# EAGLE design power_supply_module (EAGLE 6.6.0)
AUTHOR: N. Jackson; REV: A; TITLE: Power Supply Module

## Sheet 1 of 9
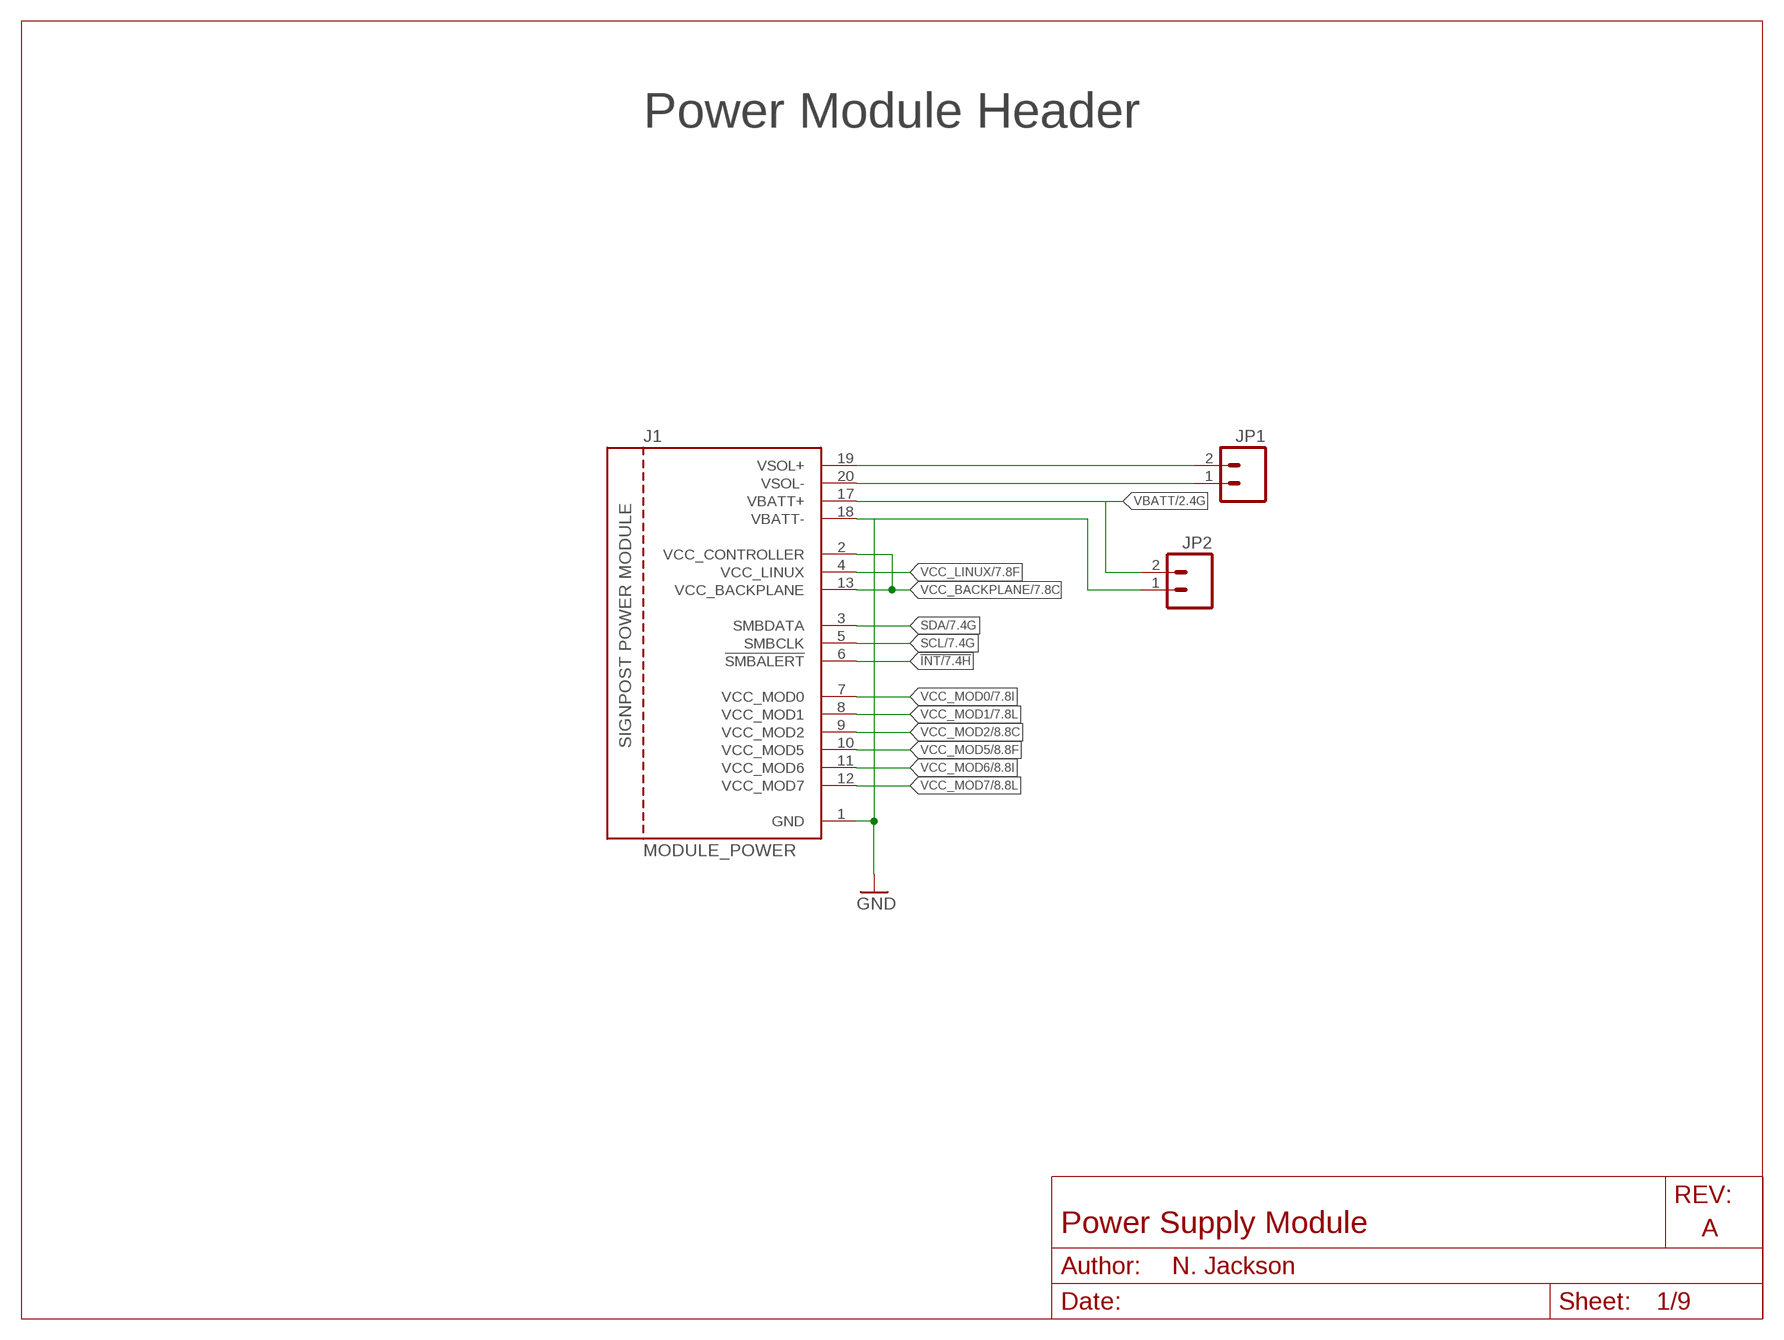
[diagram p0: schematic, sheet 1]

### Parts
J1  MODULE_POWER  [MODULE_POWER]
JP1  M02PTH  [1X02]
JP2  M02PTH  [1X02]

### Nets
!INT: J1.6(!SMBALERT) ; also sheet 7,8,9
GND: J1.1(GND) J1.18(VBATT-) JP2.1 ; also sheet 2,3,4,5,6,7,8,9
SCL: J1.5(SMBCLK) ; also sheet 7,8,9
SDA: J1.3(SMBDATA) ; also sheet 7,8,9
VBATT: J1.17(VBATT+) JP2.2 ; also sheet 2,3,4,5,6,9
VCC_BACKPLANE: J1.2(VCC_CONTROLLER) J1.13(VCC_BACKPLANE) ; also sheet 7,8,9
VCC_LINUX: J1.4(VCC_LINUX) ; also sheet 7,9
VCC_MOD0: J1.7(VCC_MOD0) ; also sheet 7,9
VCC_MOD1: J1.8(VCC_MOD1) ; also sheet 7,9
VCC_MOD2: J1.9(VCC_MOD2) ; also sheet 8,9
VCC_MOD5: J1.10(VCC_MOD5) ; also sheet 8,9
VCC_MOD6: J1.11(VCC_MOD6) ; also sheet 8,9
VCC_MOD7: J1.12(VCC_MOD7) ; also sheet 8,9
VSOL+: J1.19(VSOL+) JP1.2 ; also sheet 9
VSOL-: J1.20(VSOL-) JP1.1 ; also sheet 9

### Notes on the sheet
- Power Module Header

## Sheet 2 of 9
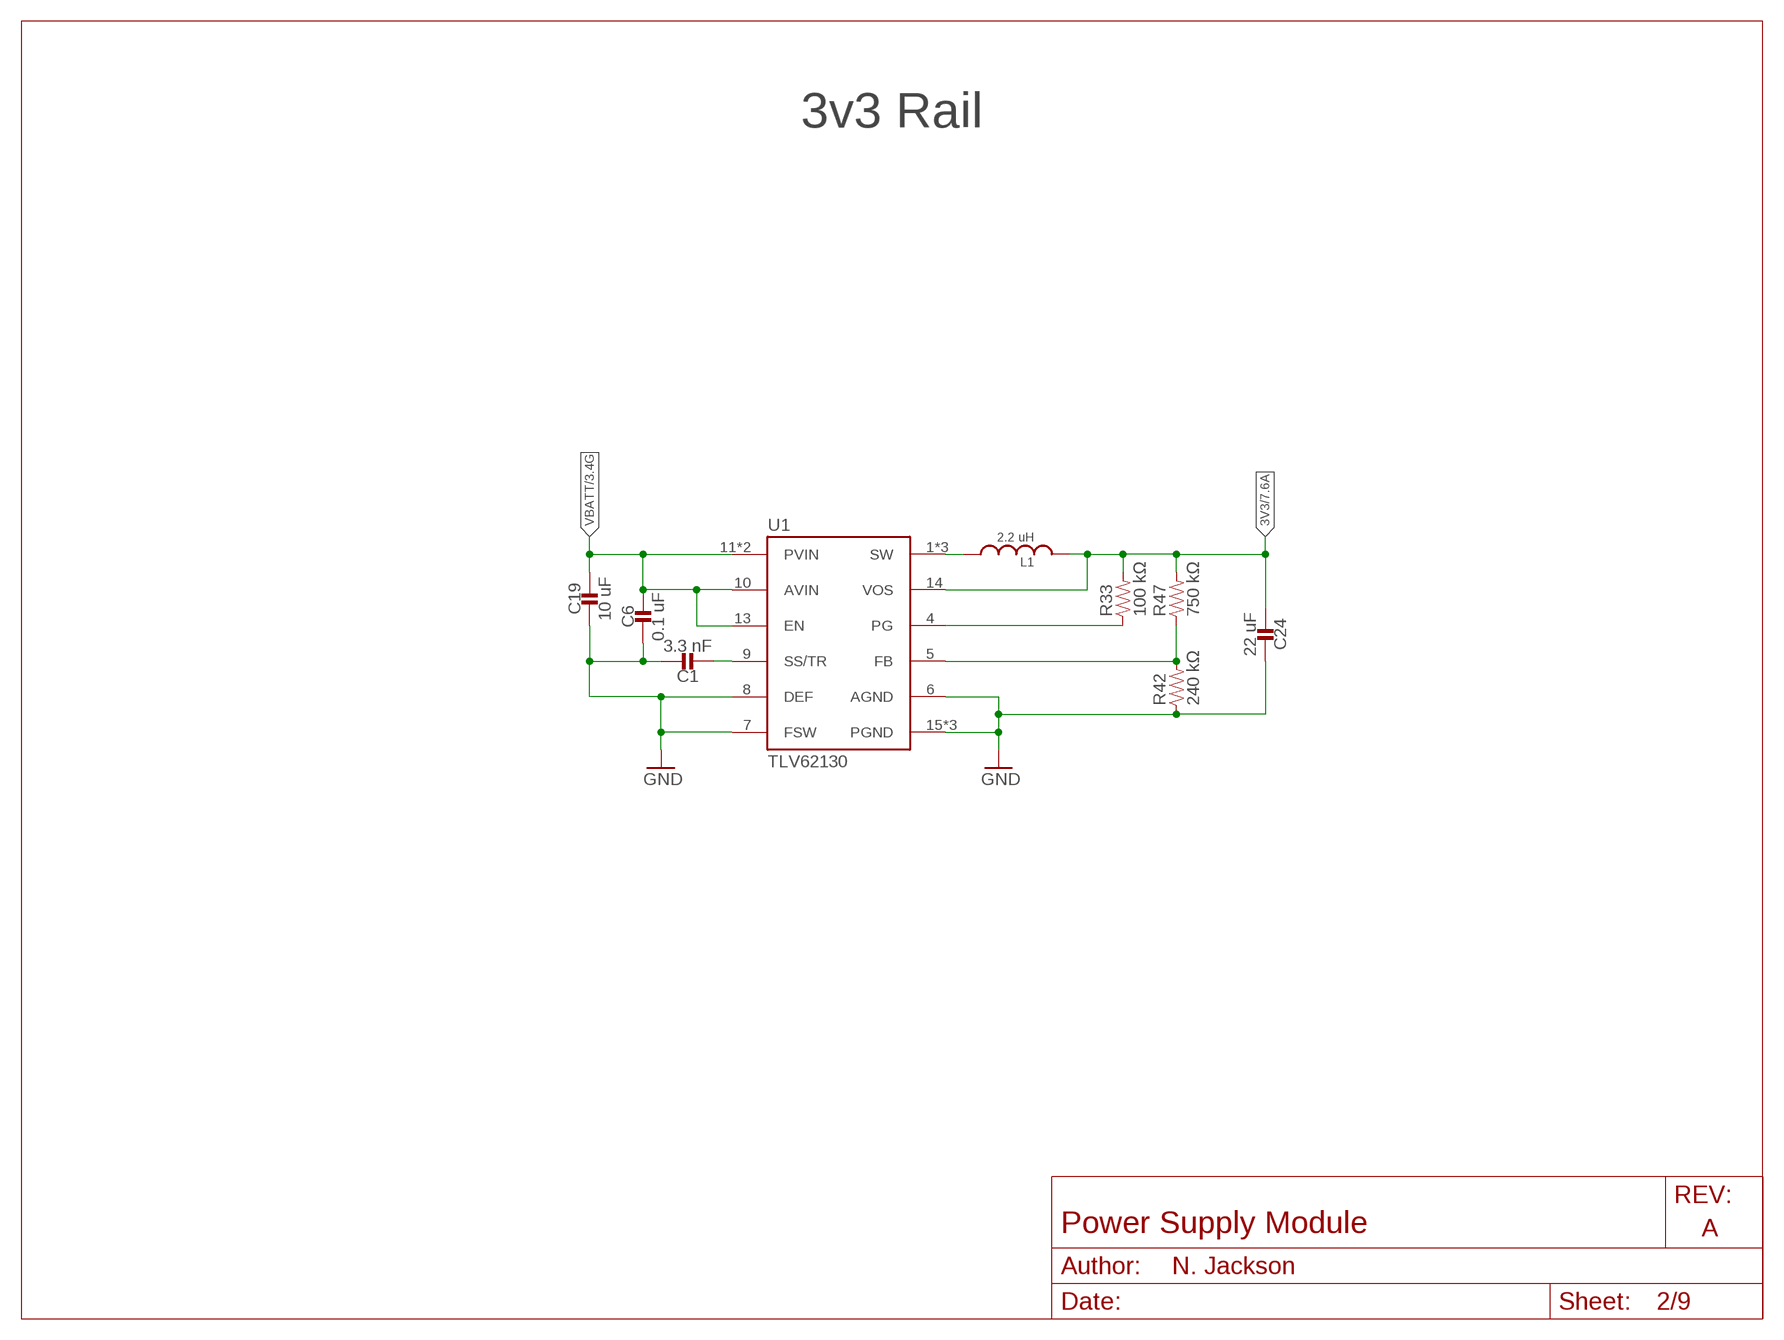
[diagram p1: schematic, sheet 2]

### Parts
C1  3.3 nF  CAPACITOR0402_CAP  [0402_CAP]
C6  0.1 uF  CAPACITOR0402_CAP  [0402_CAP]
C19  10 uF  CAPACITOR0805_CAP  [0805_CAP]
C24  22 uF  CAPACITOR0603_CAP  [0603_CAP]
L1  2.2 uH  INDUCTORIHL  [IHL-1212BZ-11]
R33  100 kΩ  RESISTOR0402_RES  [0402_RES]
R42  240 kΩ  RESISTOR0402_RES  [0402_RES]
R47  750 kΩ  RESISTOR0402_RES  [0402_RES]
U1  TLV62130  [TQFN-16/3MM]

### Nets
3V3: C24.2 L1.P$2 R33.2 R47.2 U1.14(VOS) ; also sheet 7,9
GND: C1.1 C6.2 C19.P$2 C24.1 R42.1 U1.6(AGND) U1.7(FSW) U1.8(DEF) U1.15(PGND) U1.16(PGND) U1.GND ; also sheet 1,3,4,5,6,7,8,9
N$61: C1.2 U1.9(SS/TR)
N$62: L1.P$1 U1.1(SW) U1.2(SW) U1.3(SW)
N$63: R33.1 U1.4(PG)
N$64: R42.2 R47.1 U1.5(FB)
VBATT: C6.1 C19.P$1 U1.10(AVIN) U1.11(PVIN) U1.12(PVIN) U1.13(EN) ; also sheet 1,3,4,5,6,9

### Notes on the sheet
- 3v3 Rail

## Sheet 3 of 9
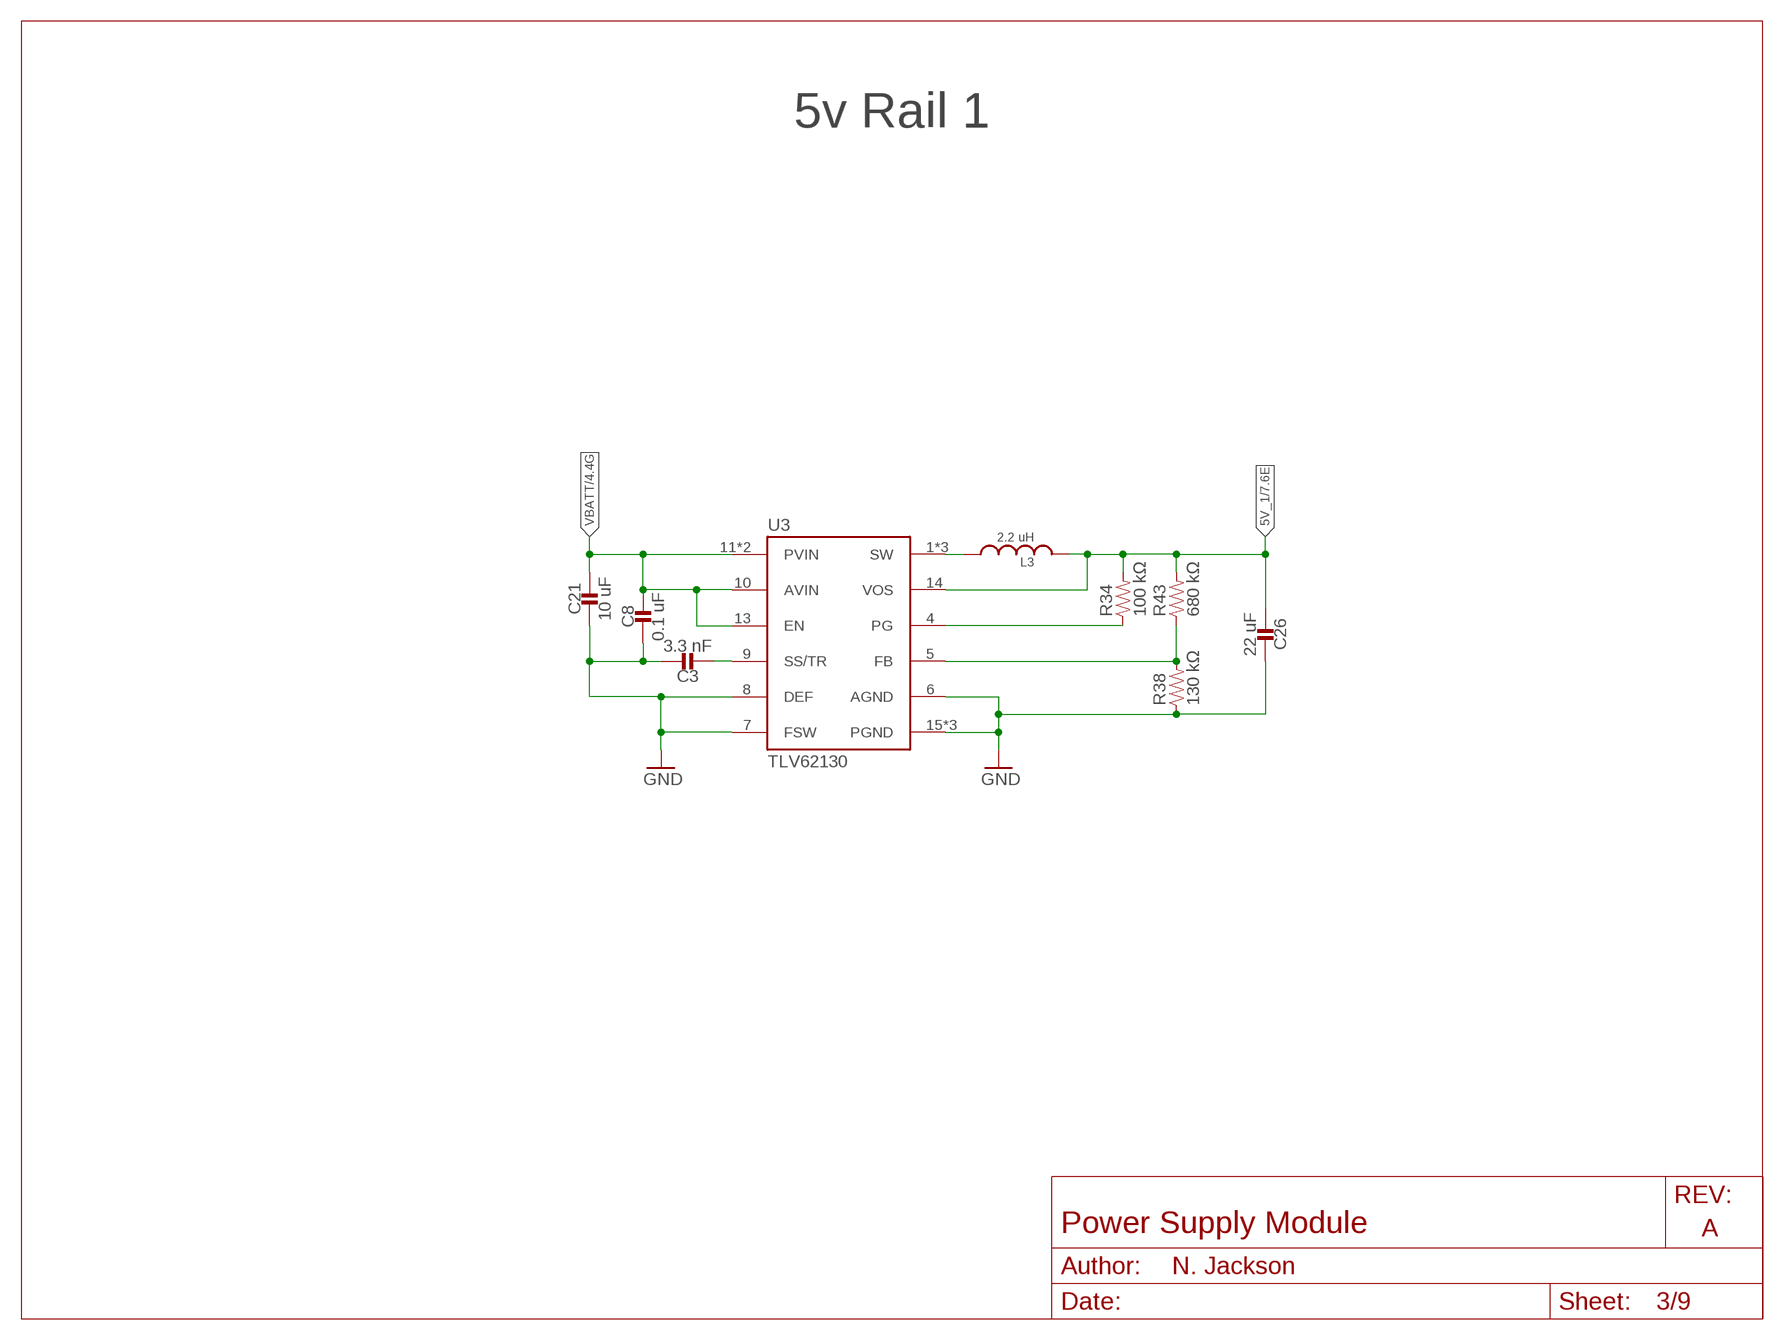
[diagram p2: schematic, sheet 3]

### Parts
C3  3.3 nF  CAPACITOR0402_CAP  [0402_CAP]
C8  0.1 uF  CAPACITOR0402_CAP  [0402_CAP]
C21  10 uF  CAPACITOR0805_CAP  [0805_CAP]
C26  22 uF  CAPACITOR0603_CAP  [0603_CAP]
L3  2.2 uH  INDUCTORIHL  [IHL-1212BZ-11]
R34  100 kΩ  RESISTOR0402_RES  [0402_RES]
R38  130 kΩ  RESISTOR0402_RES  [0402_RES]
R43  680 kΩ  RESISTOR0402_RES  [0402_RES]
U3  TLV62130  [TQFN-16/3MM]

### Nets
5V_1: C26.2 L3.P$2 R34.2 R43.2 U3.14(VOS) ; also sheet 7,9
GND: C3.1 C8.2 C21.P$2 C26.1 R38.1 U3.6(AGND) U3.7(FSW) U3.8(DEF) U3.15(PGND) U3.16(PGND) U3.GND ; also sheet 1,2,4,5,6,7,8,9
N$5: C3.2 U3.9(SS/TR)
N$6: L3.P$1 U3.1(SW) U3.2(SW) U3.3(SW)
N$7: R34.1 U3.4(PG)
N$9: R38.2 R43.1 U3.5(FB)
VBATT: C8.1 C21.P$1 U3.10(AVIN) U3.11(PVIN) U3.12(PVIN) U3.13(EN) ; also sheet 1,2,4,5,6,9

### Notes on the sheet
- 5v Rail 1

## Sheet 4 of 9
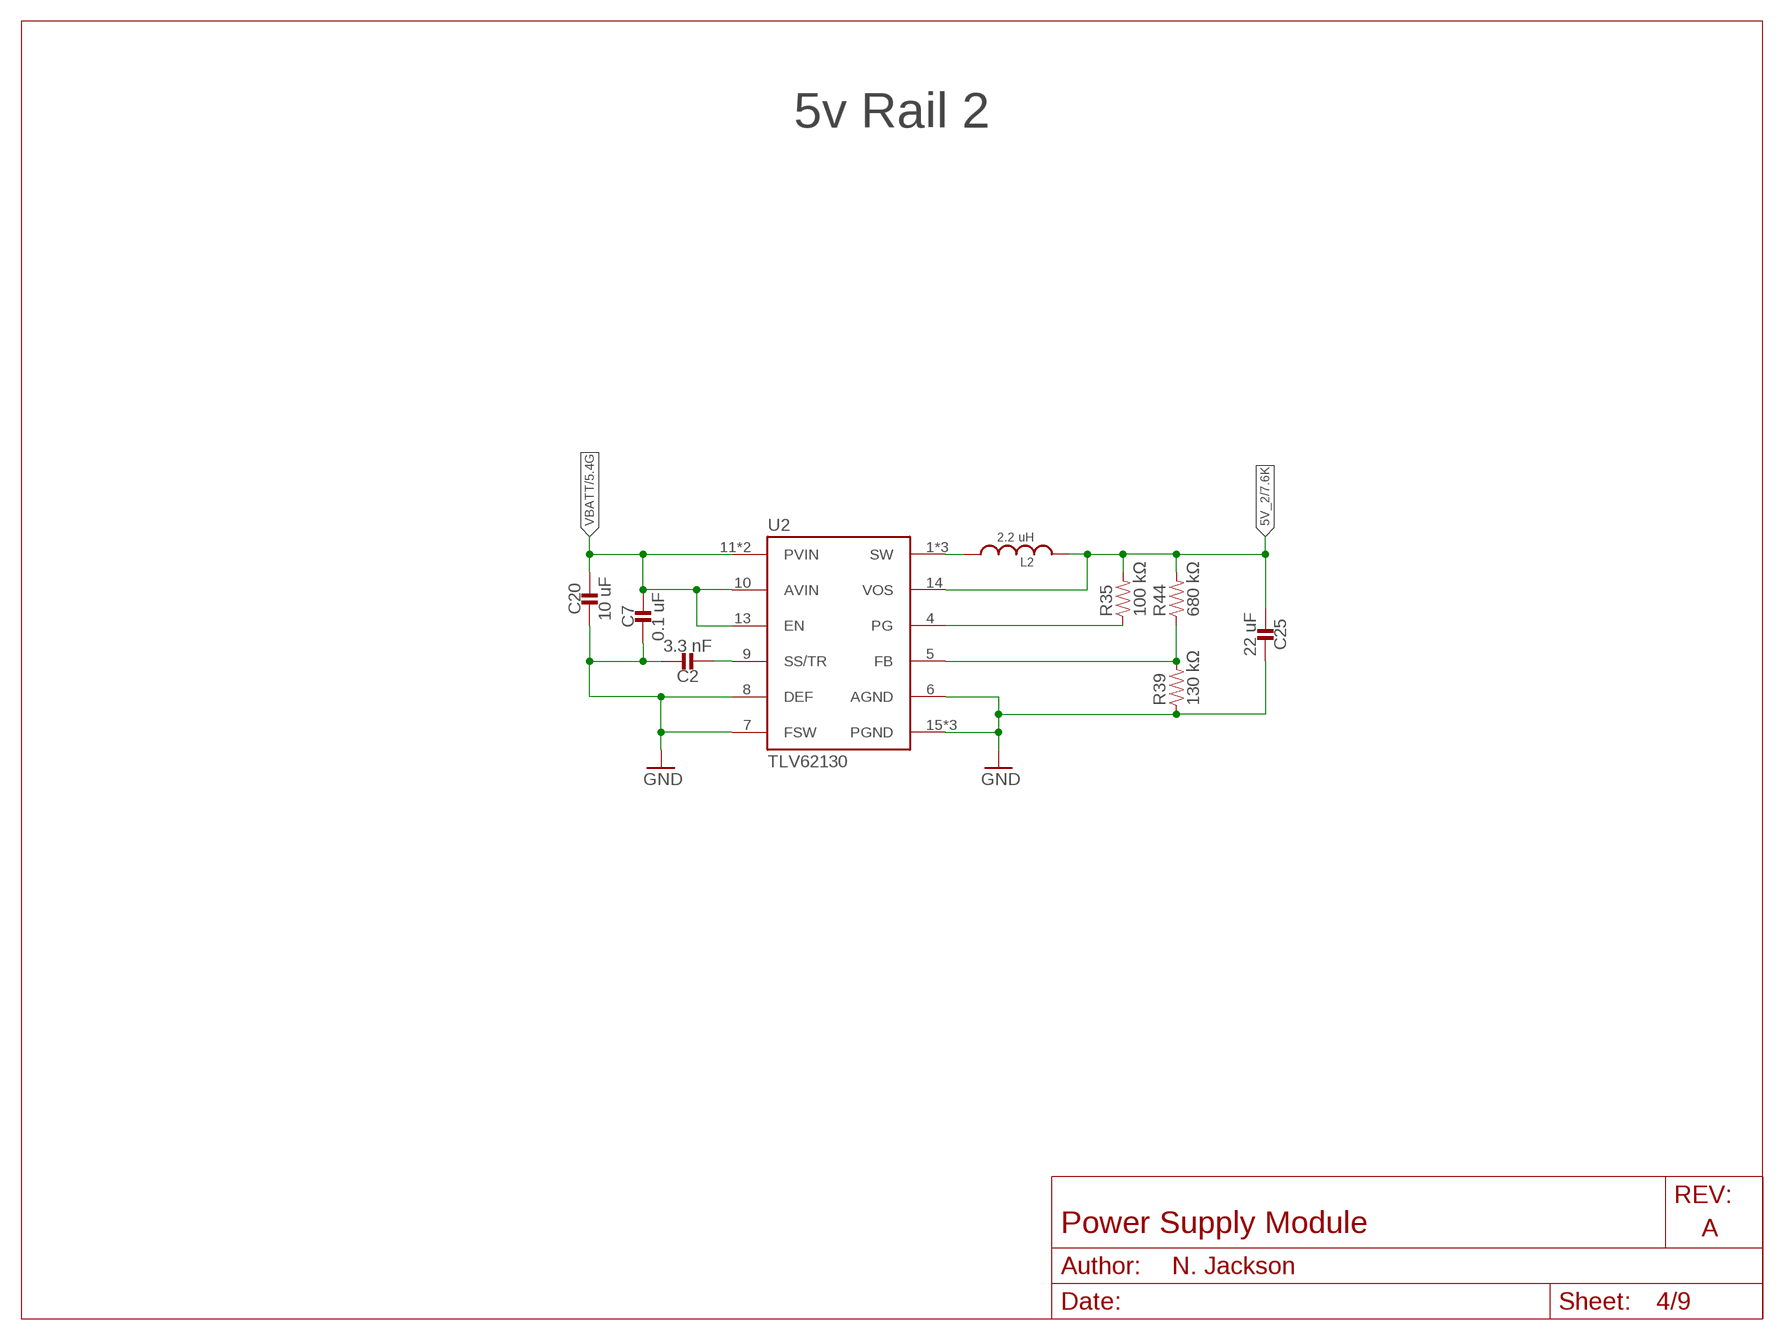
[diagram p3: schematic, sheet 4]

### Parts
C2  3.3 nF  CAPACITOR0402_CAP  [0402_CAP]
C7  0.1 uF  CAPACITOR0402_CAP  [0402_CAP]
C20  10 uF  CAPACITOR0805_CAP  [0805_CAP]
C25  22 uF  CAPACITOR0603_CAP  [0603_CAP]
L2  2.2 uH  INDUCTORIHL  [IHL-1212BZ-11]
R35  100 kΩ  RESISTOR0402_RES  [0402_RES]
R39  130 kΩ  RESISTOR0402_RES  [0402_RES]
R44  680 kΩ  RESISTOR0402_RES  [0402_RES]
U2  TLV62130  [TQFN-16/3MM]

### Nets
5V_2: C25.2 L2.P$2 R35.2 R44.2 U2.14(VOS) ; also sheet 7,9
GND: C2.1 C7.2 C20.P$2 C25.1 R39.1 U2.6(AGND) U2.7(FSW) U2.8(DEF) U2.15(PGND) U2.16(PGND) U2.GND ; also sheet 1,2,3,5,6,7,8,9
N$1: C2.2 U2.9(SS/TR)
N$2: L2.P$1 U2.1(SW) U2.2(SW) U2.3(SW)
N$3: R35.1 U2.4(PG)
N$4: R39.2 R44.1 U2.5(FB)
VBATT: C7.1 C20.P$1 U2.10(AVIN) U2.11(PVIN) U2.12(PVIN) U2.13(EN) ; also sheet 1,2,3,5,6,9

### Notes on the sheet
- 5v Rail 2

## Sheet 5 of 9
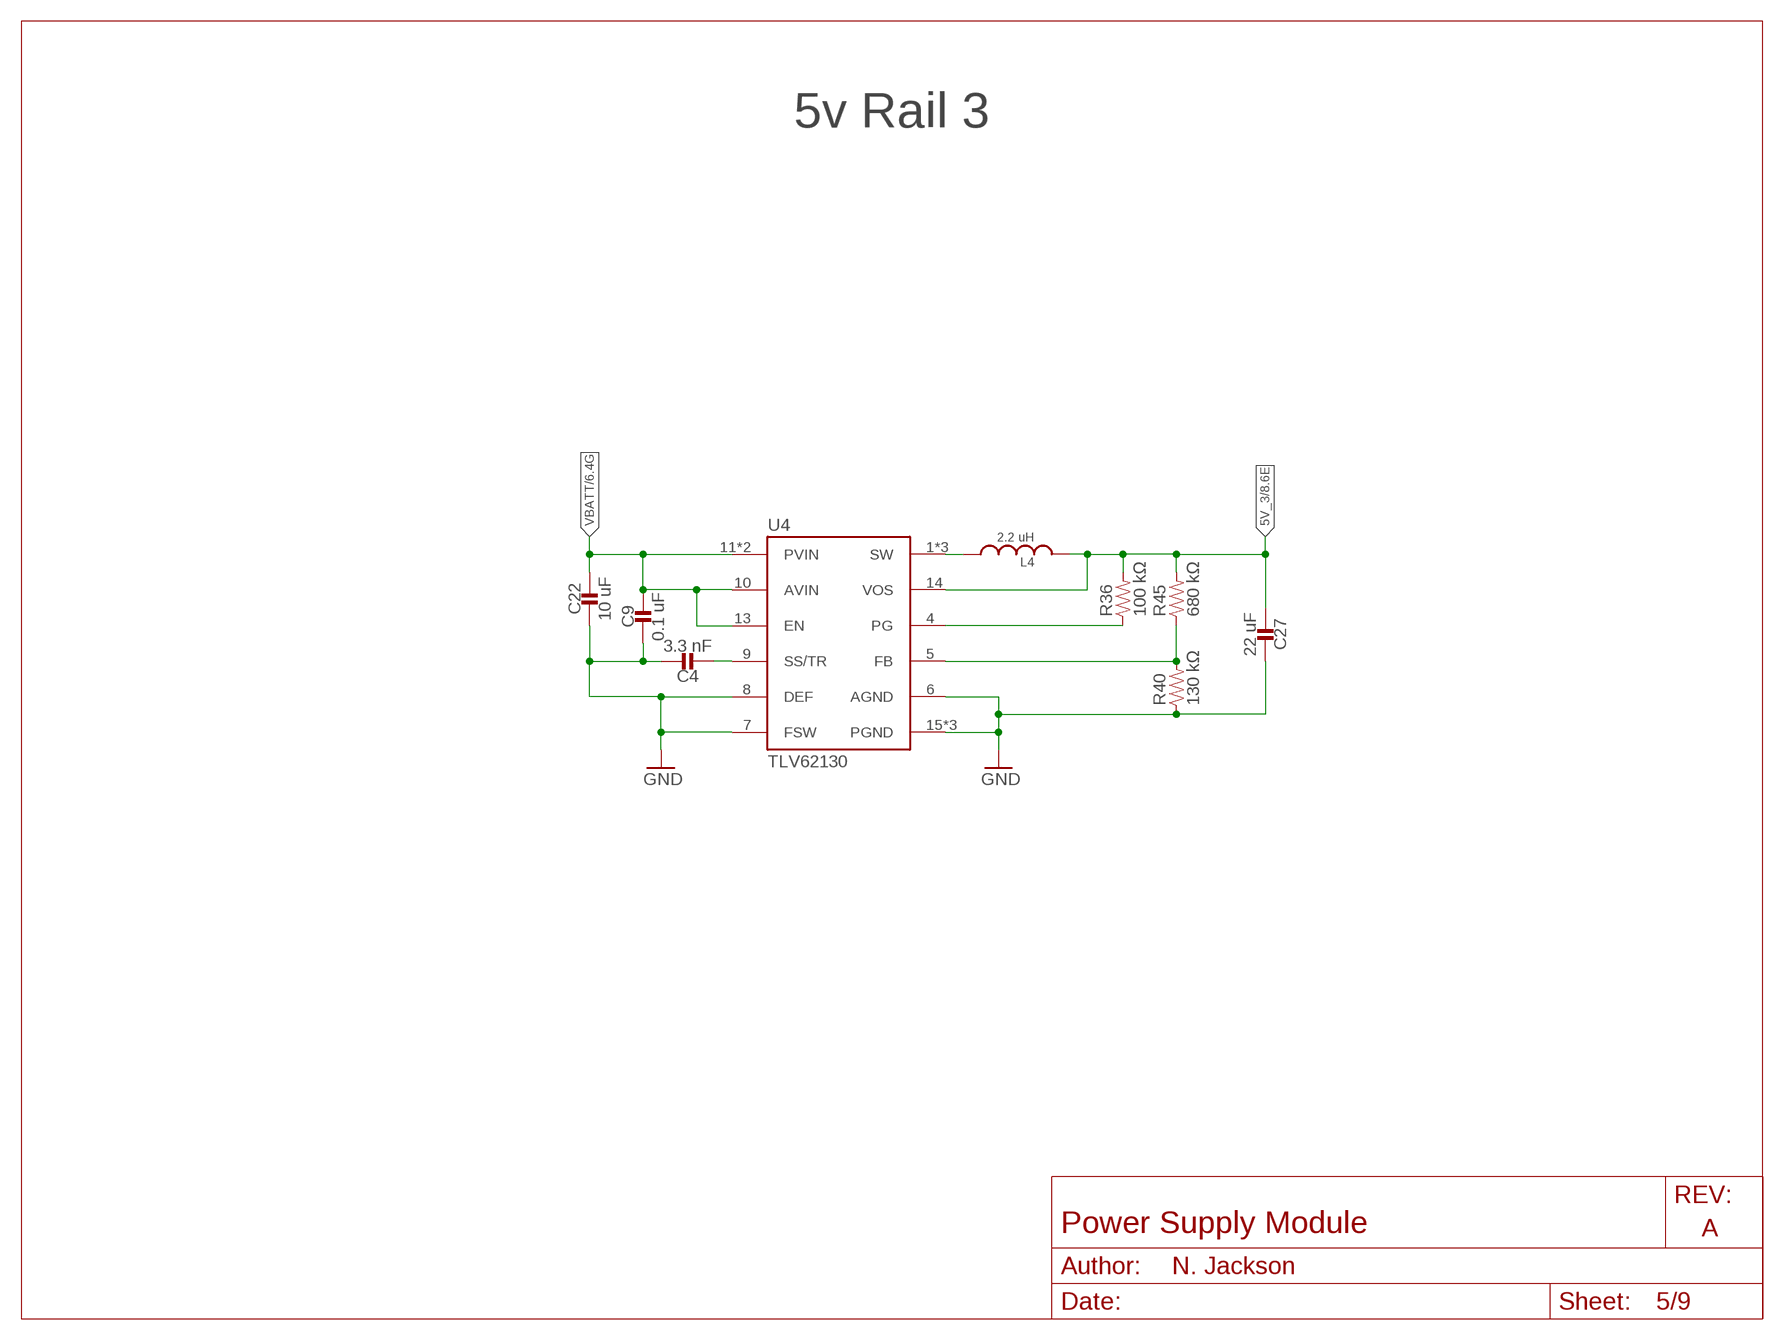
[diagram p4: schematic, sheet 5]

### Parts
C4  3.3 nF  CAPACITOR0402_CAP  [0402_CAP]
C9  0.1 uF  CAPACITOR0402_CAP  [0402_CAP]
C22  10 uF  CAPACITOR0805_CAP  [0805_CAP]
C27  22 uF  CAPACITOR0603_CAP  [0603_CAP]
L4  2.2 uH  INDUCTORIHL  [IHL-1212BZ-11]
R36  100 kΩ  RESISTOR0402_RES  [0402_RES]
R40  130 kΩ  RESISTOR0402_RES  [0402_RES]
R45  680 kΩ  RESISTOR0402_RES  [0402_RES]
U4  TLV62130  [TQFN-16/3MM]

### Nets
5V_3: C27.2 L4.P$2 R36.2 R45.2 U4.14(VOS) ; also sheet 8,9
GND: C4.1 C9.2 C22.P$2 C27.1 R40.1 U4.6(AGND) U4.7(FSW) U4.8(DEF) U4.15(PGND) U4.16(PGND) U4.GND ; also sheet 1,2,3,4,6,7,8,9
N$8: C4.2 U4.9(SS/TR)
N$10: L4.P$1 U4.1(SW) U4.2(SW) U4.3(SW)
N$11: R36.1 U4.4(PG)
N$12: R40.2 R45.1 U4.5(FB)
VBATT: C9.1 C22.P$1 U4.10(AVIN) U4.11(PVIN) U4.12(PVIN) U4.13(EN) ; also sheet 1,2,3,4,6,9

### Notes on the sheet
- 5v Rail 3

## Sheet 6 of 9
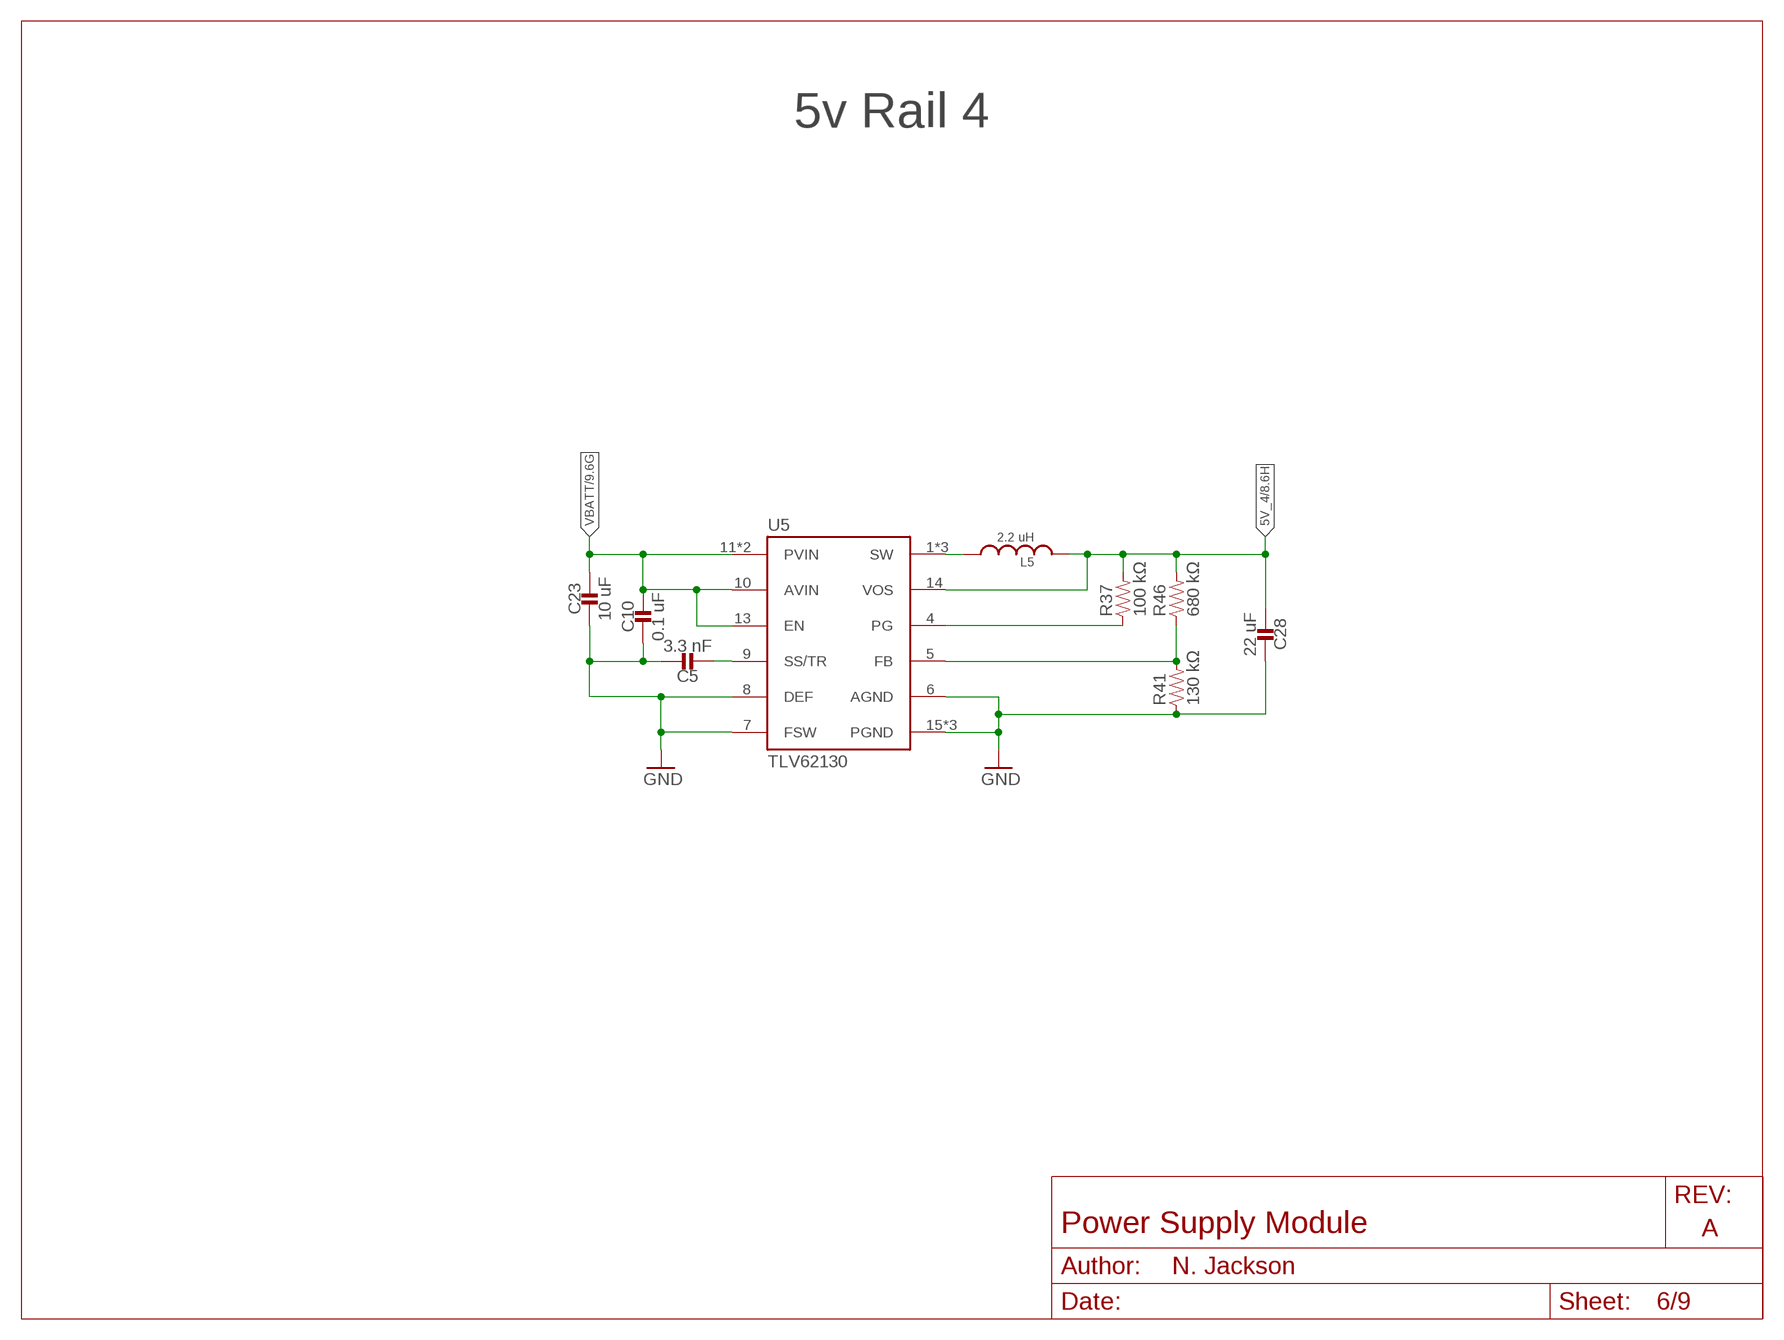
[diagram p5: schematic, sheet 6]

### Parts
C5  3.3 nF  CAPACITOR0402_CAP  [0402_CAP]
C10  0.1 uF  CAPACITOR0402_CAP  [0402_CAP]
C23  10 uF  CAPACITOR0805_CAP  [0805_CAP]
C28  22 uF  CAPACITOR0603_CAP  [0603_CAP]
L5  2.2 uH  INDUCTORIHL  [IHL-1212BZ-11]
R37  100 kΩ  RESISTOR0402_RES  [0402_RES]
R41  130 kΩ  RESISTOR0402_RES  [0402_RES]
R46  680 kΩ  RESISTOR0402_RES  [0402_RES]
U5  TLV62130  [TQFN-16/3MM]

### Nets
5V_4: C28.2 L5.P$2 R37.2 R46.2 U5.14(VOS) ; also sheet 8,9
GND: C5.1 C10.2 C23.P$2 C28.1 R41.1 U5.6(AGND) U5.7(FSW) U5.8(DEF) U5.15(PGND) U5.16(PGND) U5.GND ; also sheet 1,2,3,4,5,7,8,9
N$13: C5.2 U5.9(SS/TR)
N$14: L5.P$1 U5.1(SW) U5.2(SW) U5.3(SW)
N$15: R37.1 U5.4(PG)
N$16: R41.2 R46.1 U5.5(FB)
VBATT: C10.1 C23.P$1 U5.10(AVIN) U5.11(PVIN) U5.12(PVIN) U5.13(EN) ; also sheet 1,2,3,4,5,9

### Notes on the sheet
- 5v Rail 4

## Sheet 7 of 9
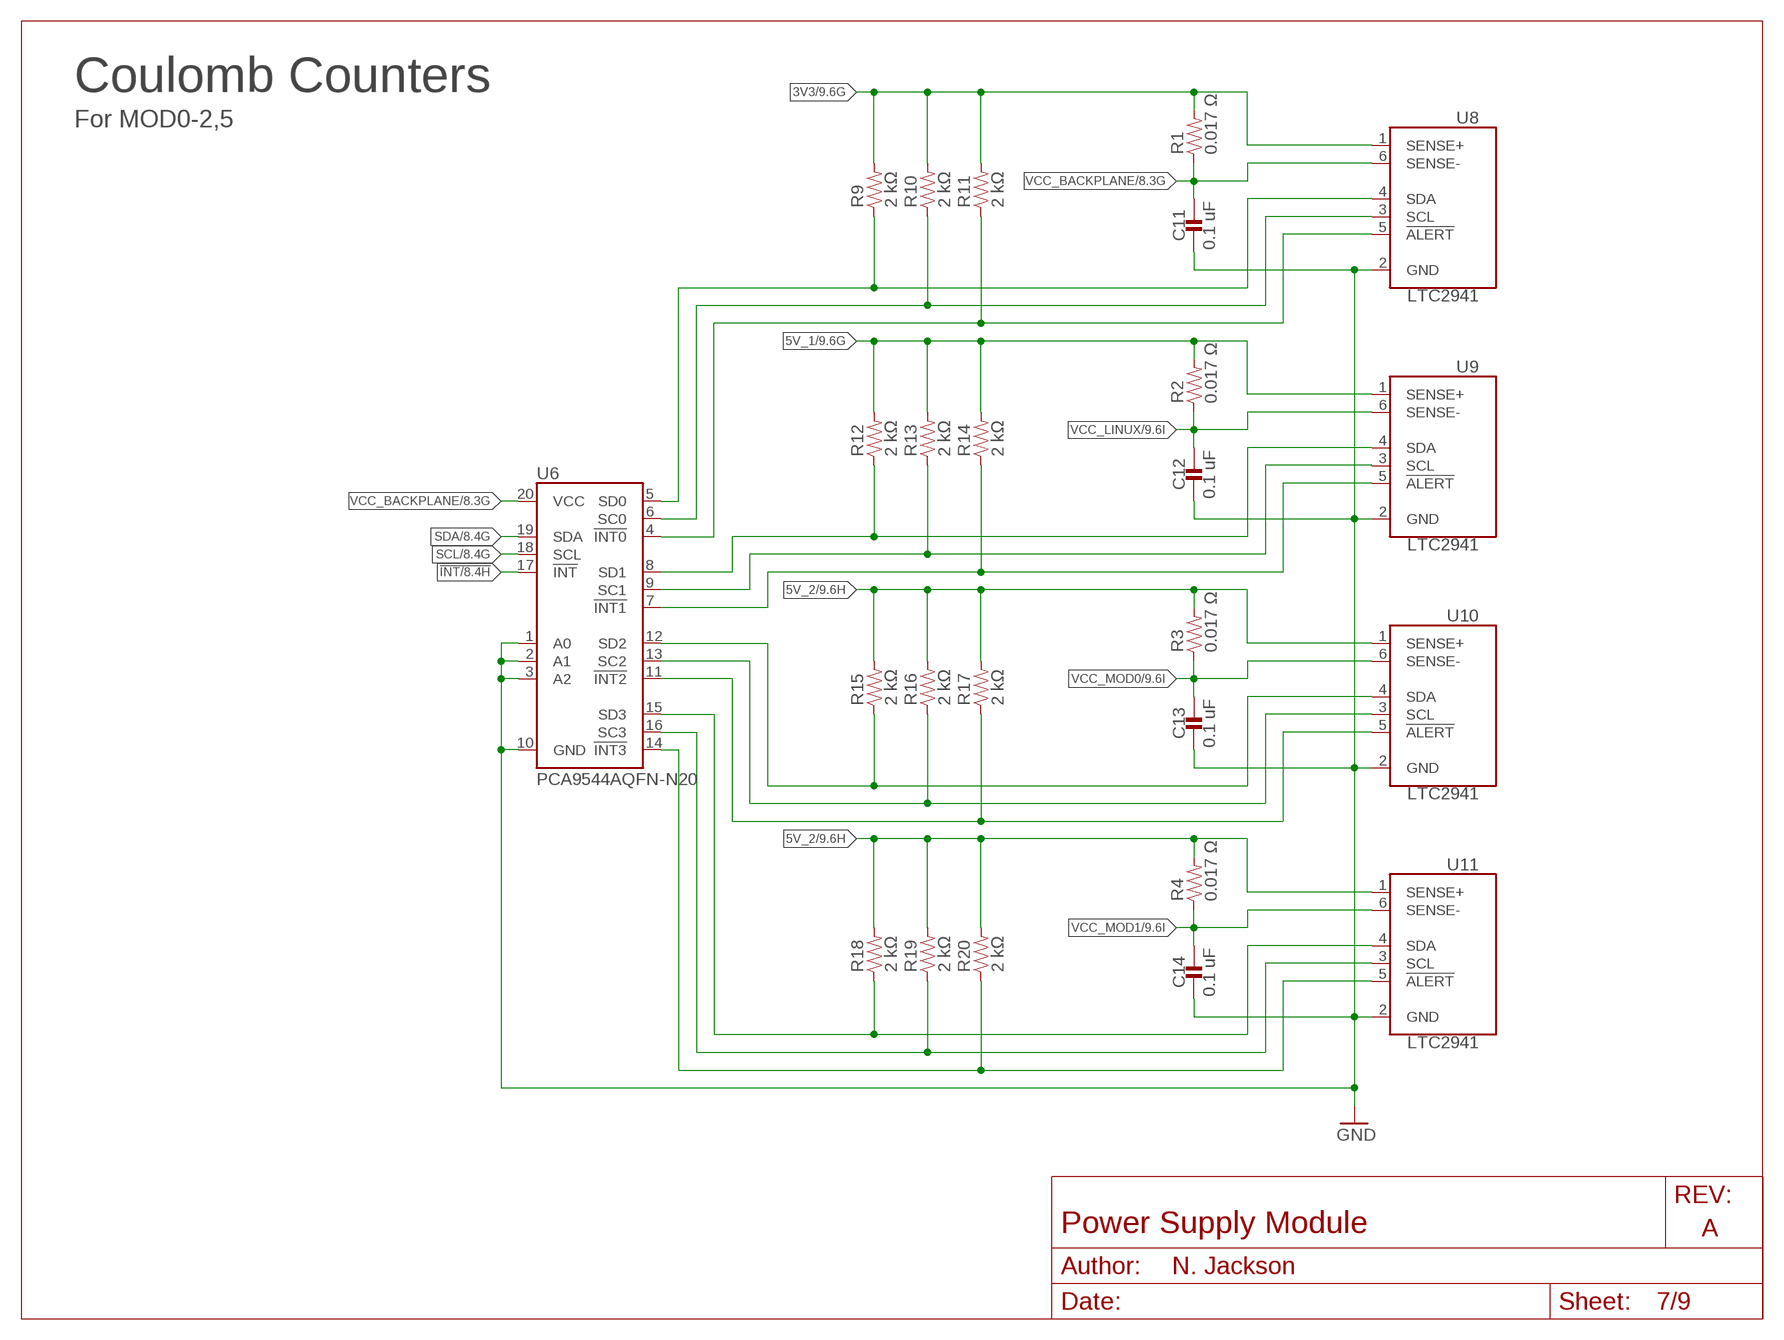
[diagram p6: schematic, sheet 7]

### Parts
C11  0.1 uF  CAPACITOR0402_CAP  [0402_CAP]
C12  0.1 uF  CAPACITOR0402_CAP  [0402_CAP]
C13  0.1 uF  CAPACITOR0402_CAP  [0402_CAP]
C14  0.1 uF  CAPACITOR0402_CAP  [0402_CAP]
R1  0.017 Ω  RESISTOR0805_RES  [0805_RES]
R2  0.017 Ω  RESISTOR0805_RES  [0805_RES]
R3  0.017 Ω  RESISTOR0805_RES  [0805_RES]
R4  0.017 Ω  RESISTOR0805_RES  [0805_RES]
R9  2 kΩ  RESISTOR0402_RES  [0402_RES]
R10  2 kΩ  RESISTOR0402_RES  [0402_RES]
R11  2 kΩ  RESISTOR0402_RES  [0402_RES]
R12  2 kΩ  RESISTOR0402_RES  [0402_RES]
R13  2 kΩ  RESISTOR0402_RES  [0402_RES]
R14  2 kΩ  RESISTOR0402_RES  [0402_RES]
R15  2 kΩ  RESISTOR0402_RES  [0402_RES]
R16  2 kΩ  RESISTOR0402_RES  [0402_RES]
R17  2 kΩ  RESISTOR0402_RES  [0402_RES]
R18  2 kΩ  RESISTOR0402_RES  [0402_RES]
R19  2 kΩ  RESISTOR0402_RES  [0402_RES]
R20  2 kΩ  RESISTOR0402_RES  [0402_RES]
U6  PCA9544AQFN-N20  [QFN-N20]
U8  LTC2941  [DFN-6-2MMX3MM]
U9  LTC2941  [DFN-6-2MMX3MM]
U10  LTC2941  [DFN-6-2MMX3MM]
U11  LTC2941  [DFN-6-2MMX3MM]

### Nets
3V3: R1.2 R9.2 R10.2 R11.2 U8.1(SENSE+) ; also sheet 2,9
5V_1: R2.2 R12.2 R13.2 R14.2 U9.1(SENSE+) ; also sheet 3,9
5V_2: R3.2 R4.2 R15.2 R16.2 R17.2 R18.2 R19.2 R20.2 U10.1(SENSE+) U11.1(SENSE+) ; also sheet 4,9
!INT: U6.17(!INT) ; also sheet 1,8,9
GND: C11.2 C12.2 C13.2 C14.2 U6.1(A0) U6.2(A1) U6.3(A2) U6.10(GND) U8.2(GND) U9.2(GND) U10.2(GND) U11.2(GND) ; also sheet 1,2,3,4,5,6,8,9
N$43: R9.1 U6.5(SD0) U8.4(SDA)
N$47: R10.1 U6.6(SC0) U8.3(SCL)
N$52: R15.1 U6.12(SD2) U10.4(SDA)
N$53: R16.1 U6.13(SC2) U10.3(SCL)
N$54: R17.1 U6.11(!INT2) U10.5(!ALERT)
N$55: R18.1 U6.15(SD3) U11.4(SDA)
N$56: R19.1 U6.16(SC3) U11.3(SCL)
N$57: R20.1 U6.14(!INT3) U11.5(!ALERT)
N$67: R11.1 U6.4(!INT0) U8.5(!ALERT)
N$68: R12.1 U6.8(SD1) U9.4(SDA)
N$70: R13.1 U6.9(SC1) U9.3(SCL)
N$71: R14.1 U6.7(!INT1) U9.5(!ALERT)
SCL: U6.18(SCL) ; also sheet 1,8,9
SDA: U6.19(SDA) ; also sheet 1,8,9
VCC_BACKPLANE: C11.1 R1.1 U6.20(VCC) U8.6(SENSE-) ; also sheet 1,8,9
VCC_LINUX: C12.1 R2.1 U9.6(SENSE-) ; also sheet 1,9
VCC_MOD0: C13.1 R3.1 U10.6(SENSE-) ; also sheet 1,9
VCC_MOD1: C14.1 R4.1 U11.6(SENSE-) ; also sheet 1,9

### Notes on the sheet
- Coulomb Counters
- For MOD0-2,5

## Sheet 8 of 9
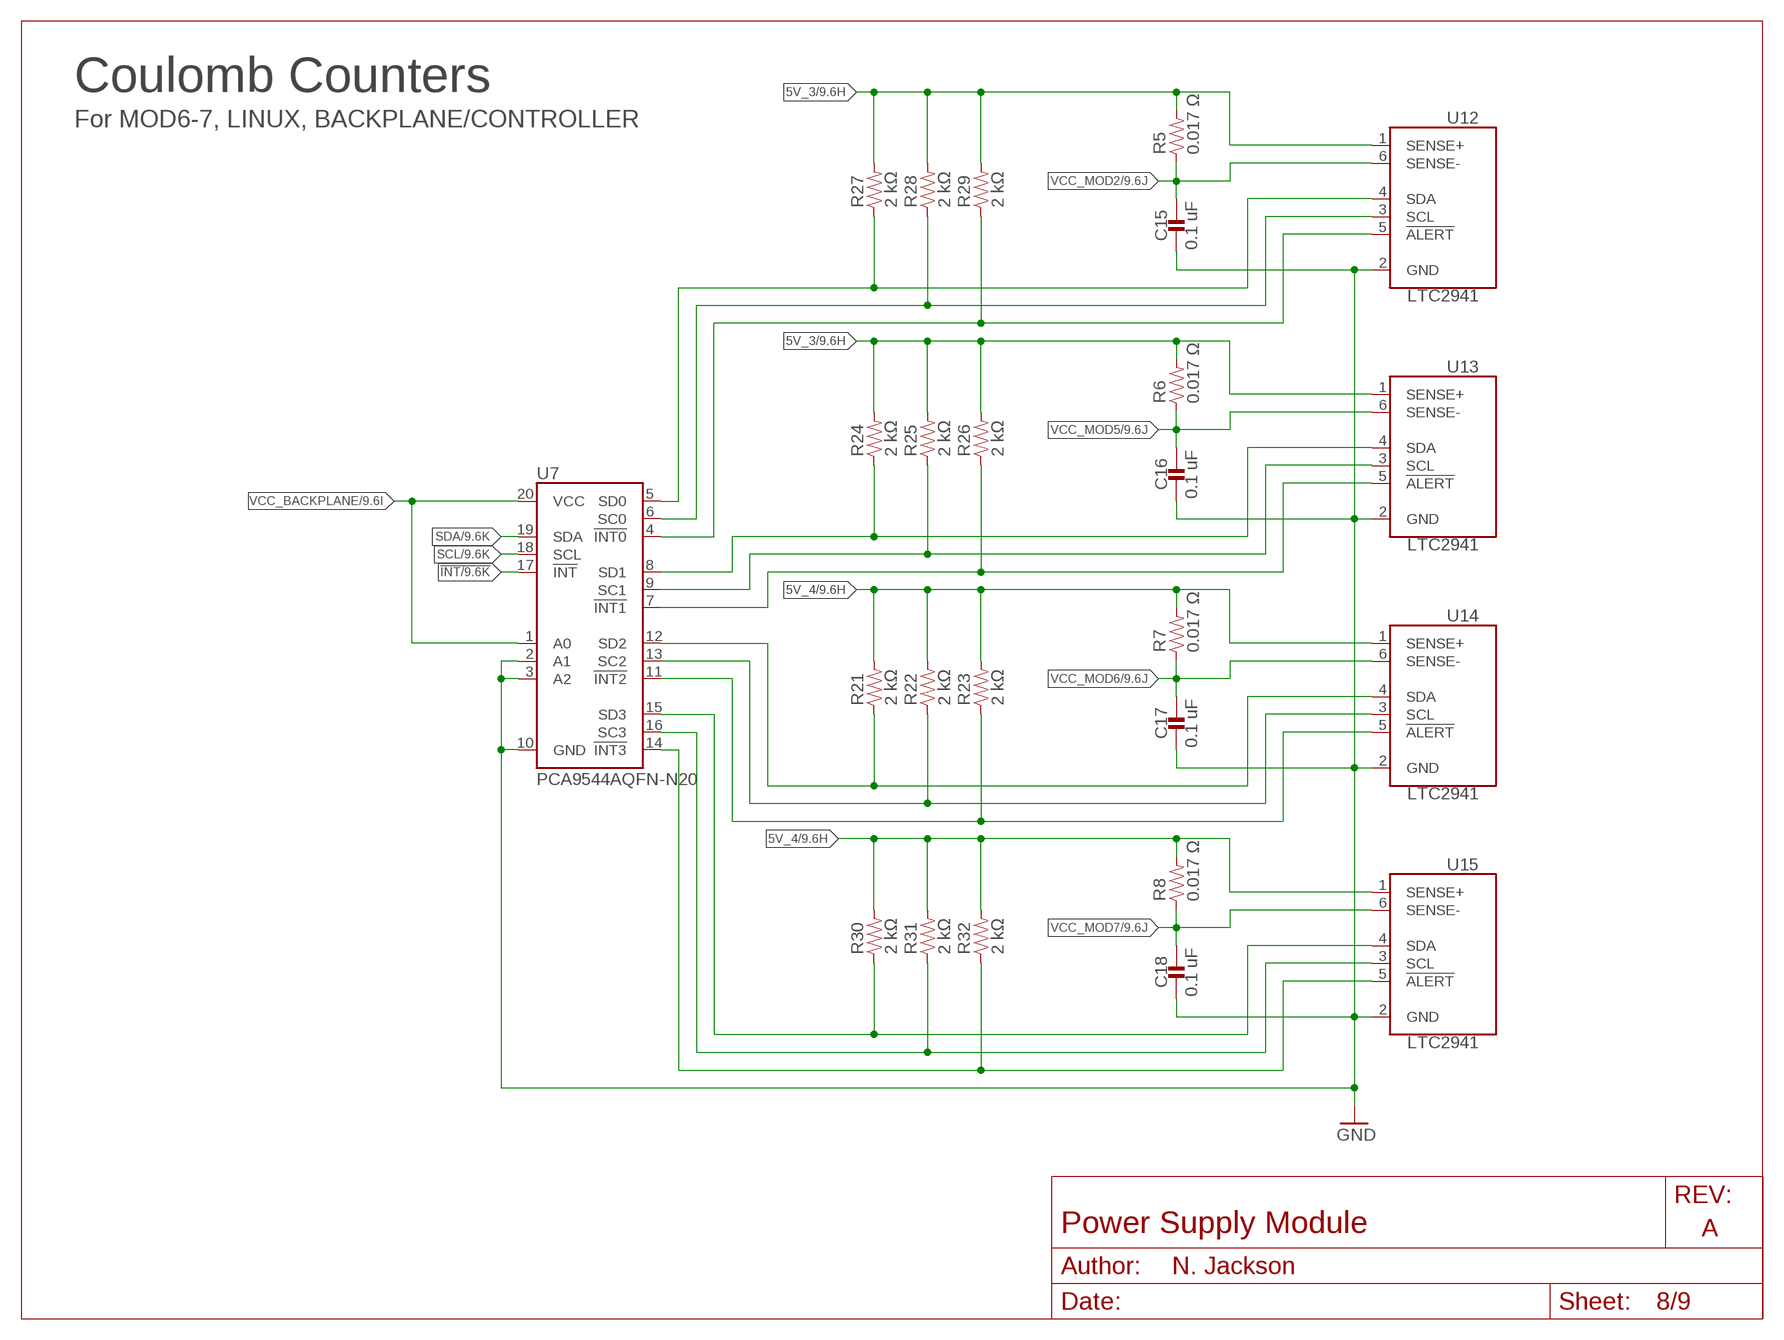
[diagram p7: schematic, sheet 8]

### Parts
C15  0.1 uF  CAPACITOR0402_CAP  [0402_CAP]
C16  0.1 uF  CAPACITOR0402_CAP  [0402_CAP]
C17  0.1 uF  CAPACITOR0402_CAP  [0402_CAP]
C18  0.1 uF  CAPACITOR0402_CAP  [0402_CAP]
R5  0.017 Ω  RESISTOR0805_RES  [0805_RES]
R6  0.017 Ω  RESISTOR0805_RES  [0805_RES]
R7  0.017 Ω  RESISTOR0805_RES  [0805_RES]
R8  0.017 Ω  RESISTOR0805_RES  [0805_RES]
R21  2 kΩ  RESISTOR0402_RES  [0402_RES]
R22  2 kΩ  RESISTOR0402_RES  [0402_RES]
R23  2 kΩ  RESISTOR0402_RES  [0402_RES]
R24  2 kΩ  RESISTOR0402_RES  [0402_RES]
R25  2 kΩ  RESISTOR0402_RES  [0402_RES]
R26  2 kΩ  RESISTOR0402_RES  [0402_RES]
R27  2 kΩ  RESISTOR0402_RES  [0402_RES]
R28  2 kΩ  RESISTOR0402_RES  [0402_RES]
R29  2 kΩ  RESISTOR0402_RES  [0402_RES]
R30  2 kΩ  RESISTOR0402_RES  [0402_RES]
R31  2 kΩ  RESISTOR0402_RES  [0402_RES]
R32  2 kΩ  RESISTOR0402_RES  [0402_RES]
U7  PCA9544AQFN-N20  [QFN-N20]
U12  LTC2941  [DFN-6-2MMX3MM]
U13  LTC2941  [DFN-6-2MMX3MM]
U14  LTC2941  [DFN-6-2MMX3MM]
U15  LTC2941  [DFN-6-2MMX3MM]

### Nets
5V_3: R5.2 R6.2 R24.2 R25.2 R26.2 R27.2 R28.2 R29.2 U12.1(SENSE+) U13.1(SENSE+) ; also sheet 5,9
5V_4: R7.2 R8.2 R21.2 R22.2 R23.2 R30.2 R31.2 R32.2 U14.1(SENSE+) U15.1(SENSE+) ; also sheet 6,9
!INT: U7.17(!INT) ; also sheet 1,7,9
GND: C15.2 C16.2 C17.2 C18.2 U7.2(A1) U7.3(A2) U7.10(GND) U12.2(GND) U13.2(GND) U14.2(GND) U15.2(GND) ; also sheet 1,2,3,4,5,6,7,9
N$21: R27.1 U7.5(SD0) U12.4(SDA)
N$22: R28.1 U7.6(SC0) U12.3(SCL)
N$23: R21.1 U7.12(SD2) U14.4(SDA)
N$24: R22.1 U7.13(SC2) U14.3(SCL)
N$25: R23.1 U7.11(!INT2) U14.5(!ALERT)
N$26: R30.1 U7.15(SD3) U15.4(SDA)
N$27: R31.1 U7.16(SC3) U15.3(SCL)
N$46: R32.1 U7.14(!INT3) U15.5(!ALERT)
N$48: R29.1 U7.4(!INT0) U12.5(!ALERT)
N$49: R24.1 U7.8(SD1) U13.4(SDA)
N$50: R25.1 U7.9(SC1) U13.3(SCL)
N$51: R26.1 U7.7(!INT1) U13.5(!ALERT)
SCL: U7.18(SCL) ; also sheet 1,7,9
SDA: U7.19(SDA) ; also sheet 1,7,9
VCC_BACKPLANE: U7.1(A0) U7.20(VCC) ; also sheet 1,7,9
VCC_MOD2: C15.1 R5.1 U12.6(SENSE-) ; also sheet 1,9
VCC_MOD5: C16.1 R6.1 U13.6(SENSE-) ; also sheet 1,9
VCC_MOD6: C17.1 R7.1 U14.6(SENSE-) ; also sheet 1,9
VCC_MOD7: C18.1 R8.1 U15.6(SENSE-) ; also sheet 1,9

### Notes on the sheet
- Coulomb Counters
- For MOD6-7, LINUX, BACKPLANE/CONTROLLER

## Sheet 9 of 9
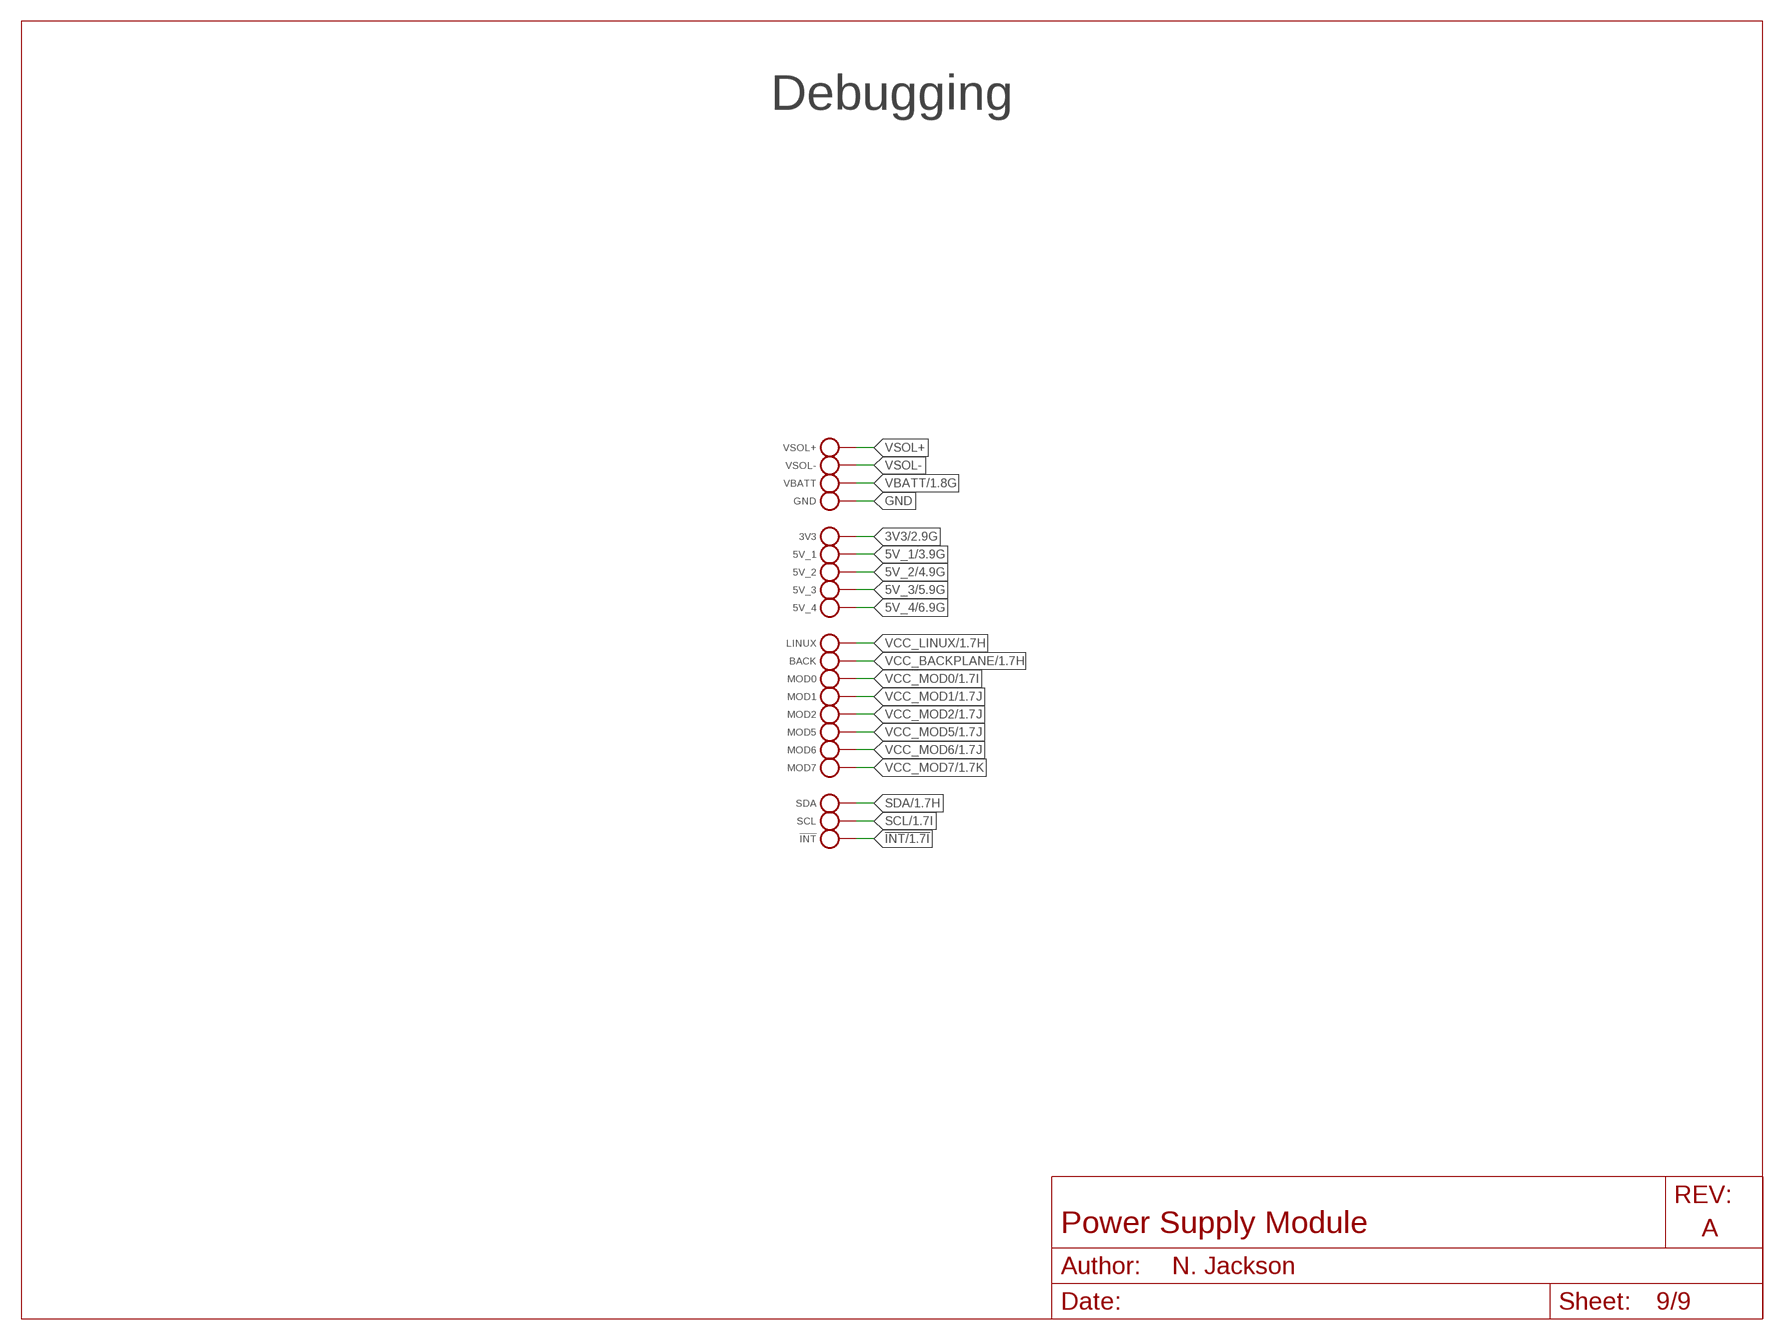
[diagram p8: schematic, sheet 9]

### Parts
3V3  TEST_POINT_0.040IN  [TESTPOINT_0.040IN]
5V_1  TEST_POINT_0.040IN  [TESTPOINT_0.040IN]
5V_2  TEST_POINT_0.040IN  [TESTPOINT_0.040IN]
5V_3  TEST_POINT_0.040IN  [TESTPOINT_0.040IN]
5V_4  TEST_POINT_0.040IN  [TESTPOINT_0.040IN]
!INT  TEST_POINT_0.040IN  [TESTPOINT_0.040IN]
BACK  TEST_POINT_0.040IN  [TESTPOINT_0.040IN]
GND  TEST_POINT_0.040IN  [TESTPOINT_0.040IN]
LINUX  TEST_POINT_0.040IN  [TESTPOINT_0.040IN]
MOD0  TEST_POINT_0.040IN  [TESTPOINT_0.040IN]
MOD1  TEST_POINT_0.040IN  [TESTPOINT_0.040IN]
MOD2  TEST_POINT_0.040IN  [TESTPOINT_0.040IN]
MOD5  TEST_POINT_0.040IN  [TESTPOINT_0.040IN]
MOD6  TEST_POINT_0.040IN  [TESTPOINT_0.040IN]
MOD7  TEST_POINT_0.040IN  [TESTPOINT_0.040IN]
SCL  TEST_POINT_0.040IN  [TESTPOINT_0.040IN]
SDA  TEST_POINT_0.040IN  [TESTPOINT_0.040IN]
VBATT  TEST_POINT_0.040IN  [TESTPOINT_0.040IN]
VSOL+  TEST_POINT_0.040IN  [TESTPOINT_0.040IN]
VSOL-  TEST_POINT_0.040IN  [TESTPOINT_0.040IN]

### Nets
3V3: 3V3.TESTPOINT ; also sheet 2,7
5V_1: 5V_1.TESTPOINT ; also sheet 3,7
5V_2: 5V_2.TESTPOINT ; also sheet 4,7
5V_3: 5V_3.TESTPOINT ; also sheet 5,8
5V_4: 5V_4.TESTPOINT ; also sheet 6,8
!INT: !INT.TESTPOINT ; also sheet 1,7,8
GND: GND.TESTPOINT ; also sheet 1,2,3,4,5,6,7,8
SCL: SCL.TESTPOINT ; also sheet 1,7,8
SDA: SDA.TESTPOINT ; also sheet 1,7,8
VBATT: VBATT.TESTPOINT ; also sheet 1,2,3,4,5,6
VCC_BACKPLANE: BACK.TESTPOINT ; also sheet 1,7,8
VCC_LINUX: LINUX.TESTPOINT ; also sheet 1,7
VCC_MOD0: MOD0.TESTPOINT ; also sheet 1,7
VCC_MOD1: MOD1.TESTPOINT ; also sheet 1,7
VCC_MOD2: MOD2.TESTPOINT ; also sheet 1,8
VCC_MOD5: MOD5.TESTPOINT ; also sheet 1,8
VCC_MOD6: MOD6.TESTPOINT ; also sheet 1,8
VCC_MOD7: MOD7.TESTPOINT ; also sheet 1,8
VSOL+: VSOL+.TESTPOINT ; also sheet 1
VSOL-: VSOL-.TESTPOINT ; also sheet 1

### Notes on the sheet
- Debugging

## Library data of the parts
3V3 5V_1-5V_4 !INT BACK GND LINUX MOD0 MOD1 MOD2 MOD5-MOD7 SCL SDA VBATT VSOL+ VSOL- = headers:TEST_POINT_0.040IN: 0.040in Test Point; DIGIKEY: 5001K-ND
C1-C28 = passives:CAPACITOR: 0402 Capacitor
J1 = signpost:MODULE_POWER: Header for power module for signpost; DIGIKEY: S9172-ND
JP1 JP2 = SparkFun-Connectors:M02: Header 2 Standard 2-pin 0.1" header. Use with straight break away headers (SKU : PRT-00116), right angle break away headers (PRT-00553), swiss pins (PRT-00743), machine pins (PRT-00117), and female headers (PRT-00115). Molex polarized connector foot print use with SKU : PRT-08233 with associated crimp pins and housings.
L1-L5 = passives:INDUCTOR: A very specific inductor; DIGIKEY: 541-1322-1-ND
R1-R47 = passives:RESISTOR: Resistor Basic schematic elements and footprints for 0603, 1206, and PTH resistors.
U1-U5 = chips:TLV62130: High Efficient 3A switching step-down regulator. 1V-5V out, 4V-17V in.; DIGIKEY: 296-35978-1-ND
U6 U7 = signpost:PCA9544A: 1-4 I2C/SMBUS Multiplexer with interrupt for power supply coulomb counters; DIGIKEY: 296-20960-1-ND
U8-U15 = signpost:LTC2941: I2C Battery Gas Gauge with External Sense Resistor; DIGIKEY: LTC2941IDCB#TRMPBFCT-ND

## Board
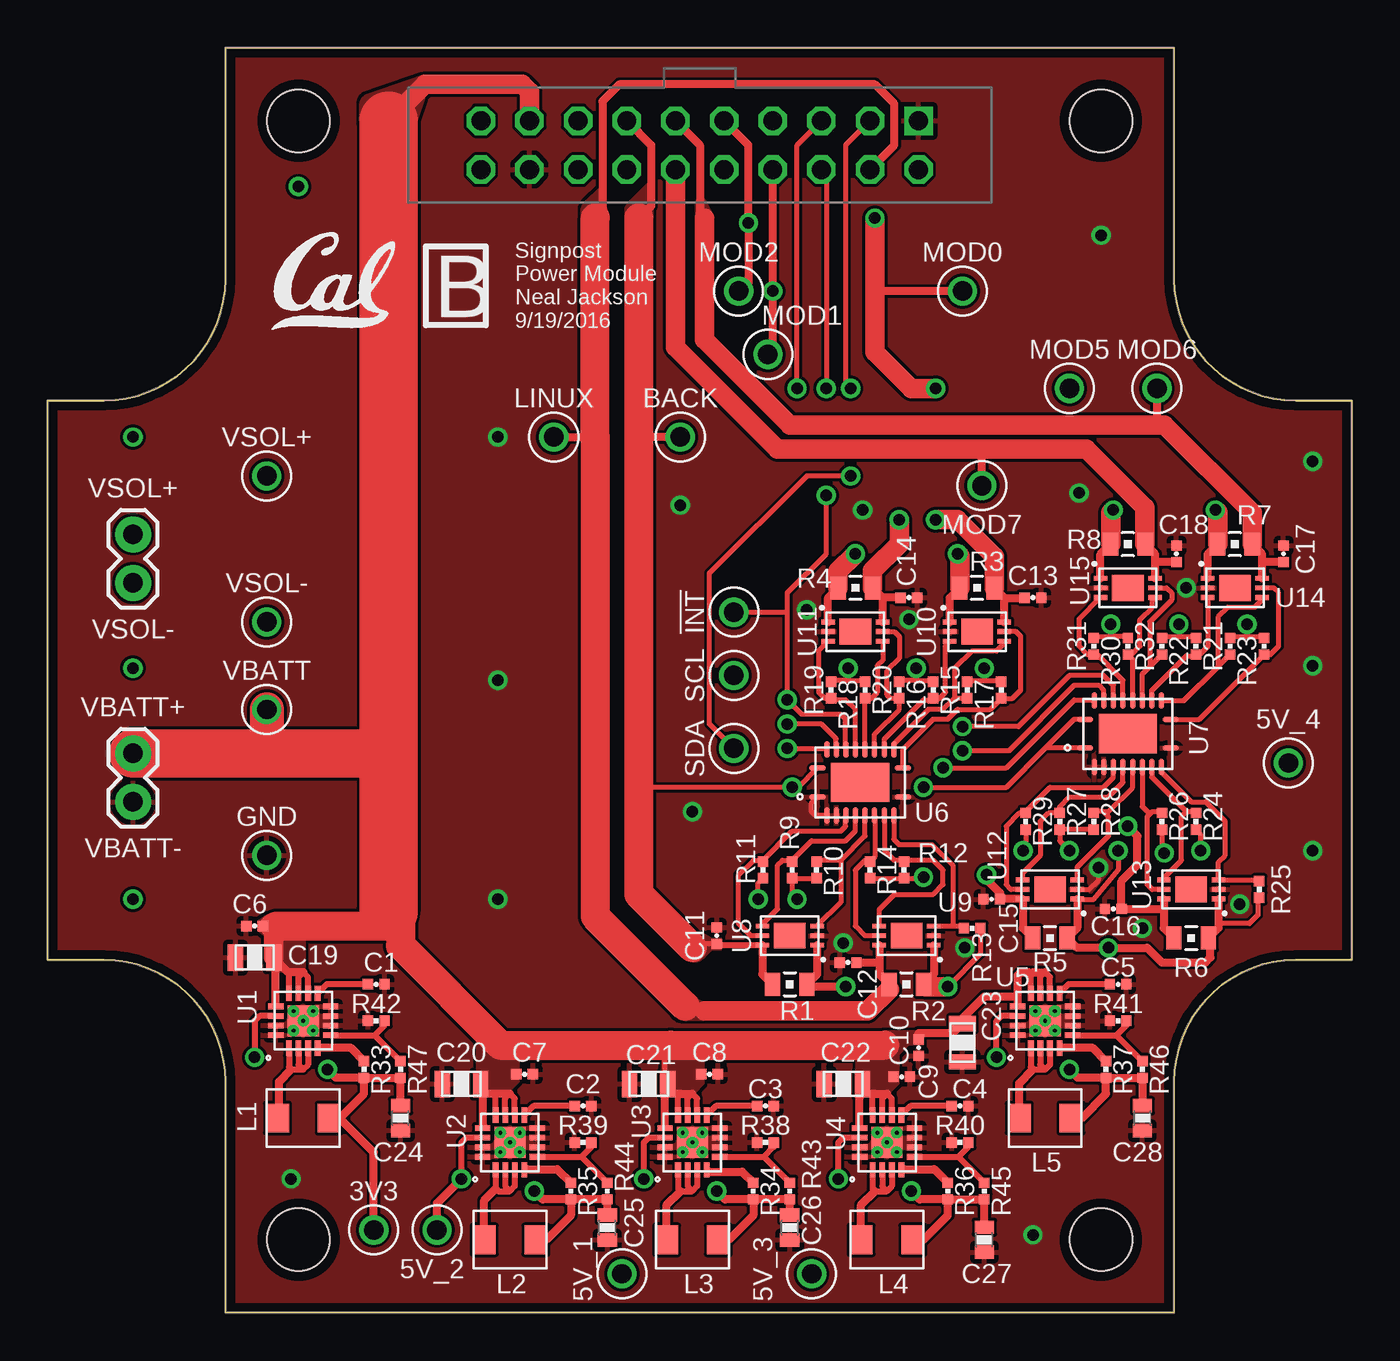
[diagram p9: board, top side]
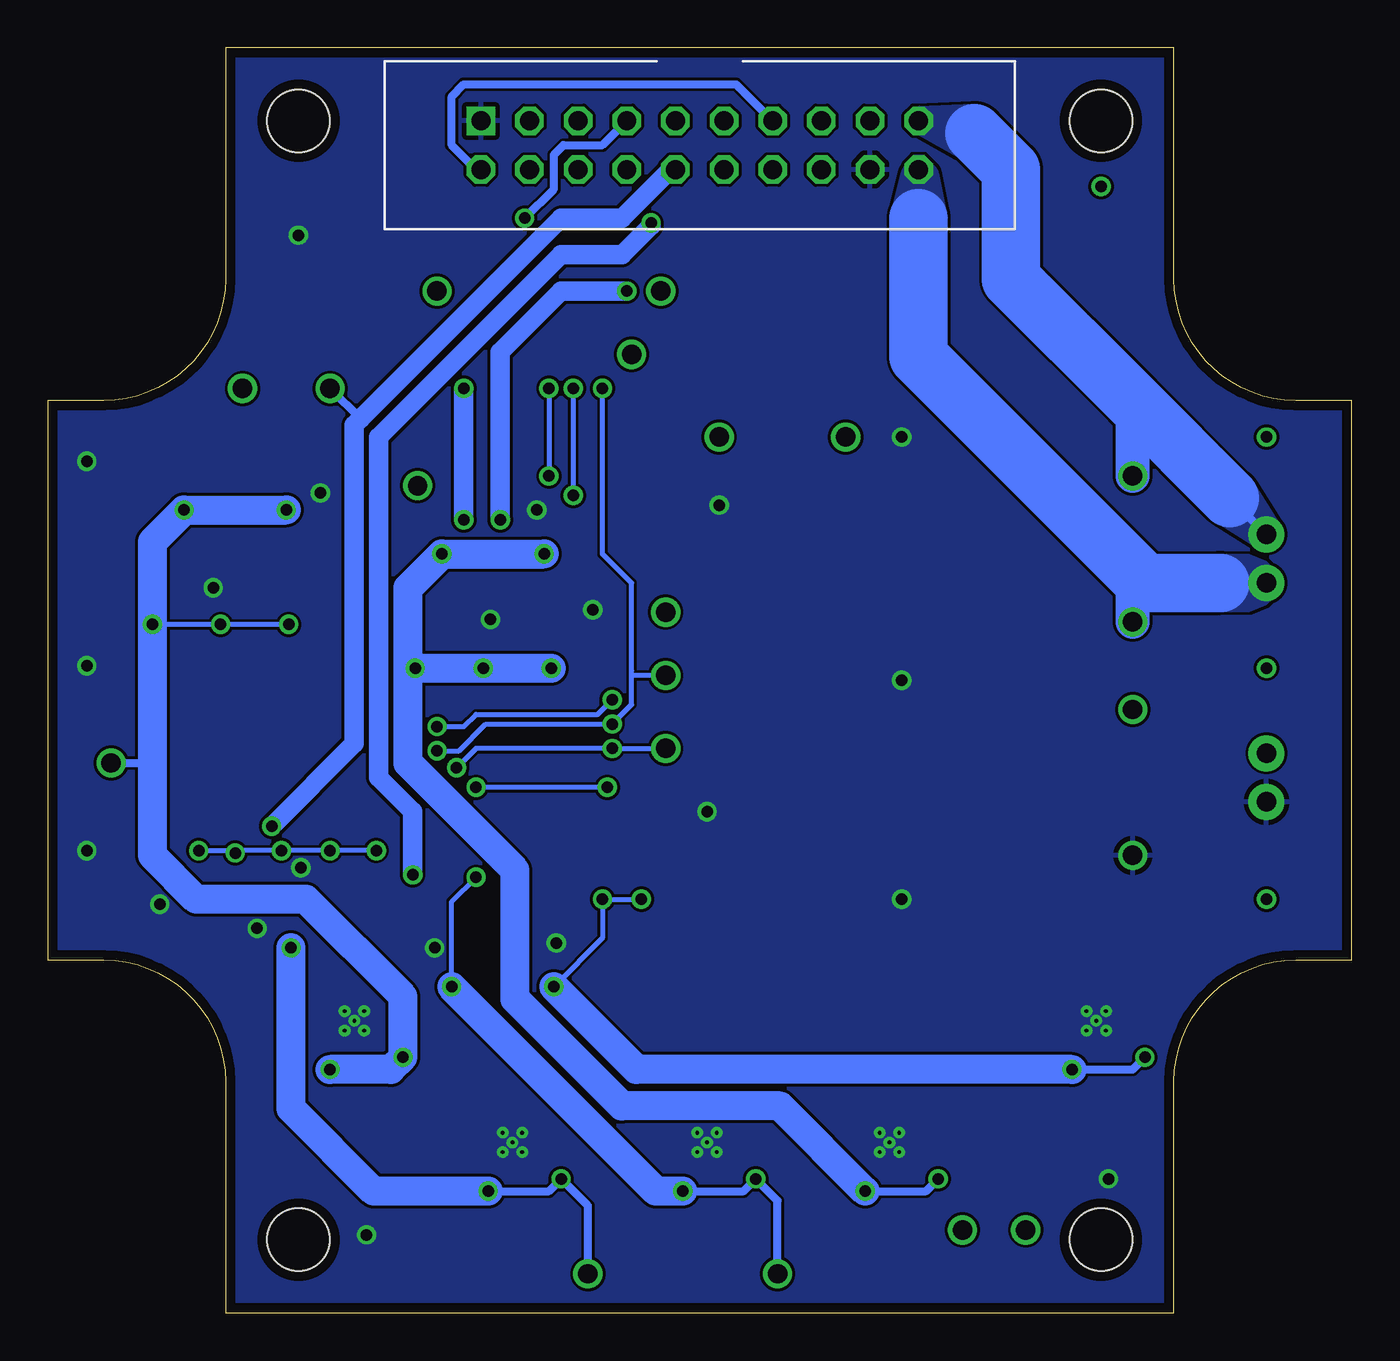
[diagram p10: board, bottom side, seen from below]

Size 68.07 x 66.04 mm. Coordinates in mm from the lower left corner, seen from the top.
Outline: 9.27,0 9.27,12.06 arc90 2.92,18.41 0,18.41 0,47.62 2.92,47.62 arc90 9.27,53.98 9.27,66.04 58.8,66.04 58.8,53.98 arc90 65.15,47.62 68.07,47.62 68.07,18.41 65.15,18.41 arc90 58.8,12.06 58.8,0 9.27,0
Copper layers (1*16): Top 0.0178mm / dielectric 59mil / Bottom 0.0178mm
Design rules "sunstone-2lyr_v1.0.0.3 *": minimum track width 6mil, minimum drill 14mil, track to track 6mil, track to pad 6mil, pad to pad 6mil, via to via 6mil, smd to smd 6mil, copper to edge 20mil, drill to drill 16mil, minimum pad ring 8mil, minimum via ring 8mil, stop-mask expansion 3mil, vias tented up to drill 30mil, thermal gap 10mil
Holes 3.26 mm at 13.08,62.23 54.99,62.23 13.08,3.81 54.99,3.81

### Footprints (pad centres in the part's own frame; a part is rotated, then mirrored left to right if it is on the bottom)
TESTPOINT_0.040IN = drill 1.016: TESTPOINT 0,0
0402_CAP = smd 0.536 x 0.546: 1 -0.433,0; 2 0.433,0
0805_CAP = smd 0.8 x 1.4: P$1 1,0; P$2 -1,0
0603_CAP = smd 0.7 x 1: 1 -0.65,0; 2 0.65,0
MODULE_POWER = drill 0.991 square: 1 11.43,29.21 | drill 0.991 octagon: 2 11.43,26.67; 3 8.89,29.21; 4 8.89,26.67; 5 6.35,29.21; 6 6.35,26.67; 7 3.81,29.21; 8 3.81,26.67; 9 1.27,29.21; 10 1.27,26.67; 11 -1.27,29.21; 12 -1.27,26.67; 13 -3.81,29.21; 14 -3.81,26.67; 15 -6.35,29.21; 16 -6.35,26.67; 17 -8.89,29.21; 18 -8.89,26.67; 19 -11.43,29.21; 20 -11.43,26.67
1X02 = drill 1.016 pad 1.88: 1 0,0; 2 2.54,0
IHL-1212BZ-11 = smd 1.2 x 1.5: P$1 -1.35,0; P$2 1.35,0
0805_RES = smd 0.8 x 1.2: 1 -0.9,0; 2 0.9,0
0402_RES = smd 0.536 x 0.546: 1 -0.433,0; 2 0.433,0
TQFN-16/3MM = smd 0.3 x 0.8: 1 -0.75,-1.43; 2 -0.25,-1.43; 3 0.25,-1.43; 4 0.75,-1.43; 9 0.75,1.43; 10 0.25,1.43; 11 -0.25,1.43; 12 -0.75,1.43 | smd 0.8 x 0.3: 5 1.43,-0.75; 6 1.43,-0.25; 7 1.43,0.25; 8 1.43,0.75; 13 -1.43,0.75; 14 -1.43,0.25; 15 -1.43,-0.25; 16 -1.43,-0.75 | smd 1.63 x 1.63: GND 0,0
QFN-N20 = smd 0.85 x 0.28: 1 -2.23,-0.75; 10 2.23,-0.75; 11 2.23,0.75; 20 -2.23,0.75 | smd 0.28 x 0.85: 2 -1.75,-1.73; 3 -1.25,-1.73; 4 -0.75,-1.73; 5 -0.25,-1.73; 6 0.25,-1.73; 7 0.75,-1.73; 8 1.25,-1.73; 9 1.75,-1.73; 12 1.75,1.73; 13 1.25,1.73; 14 0.75,1.73; 15 0.25,1.73; 16 -0.25,1.73; 17 -0.75,1.73; 18 -1.25,1.73; 19 -1.75,1.73 | smd 3.05 x 2.05: P$22 0,0
DFN-6-2MMX3MM = smd 0.25 x 0.7: 1 -0.5,-1.425; 2 0,-1.425; 3 0.5,-1.425; 4 0.5,1.425; 5 0,1.425; 6 -0.5,1.425 | smd 1.35 x 1.65: NC 0,0

### Placement (x,y rotation side)
3V3  17.02,4.32 0 top
5V_1  29.97,2.03 0 top
5V_2  20.32,4.32 0 top
5V_3  39.88,2.03 0 top
5V_4  64.77,28.7 0 top
!INT  35.81,36.58 0 top
BACK  33.02,45.72 0 top
C1  17.14,17.14 180 top
C2  27.94,10.79 180 top
C3  37.47,10.79 180 top
C4  47.62,10.79 180 top
C5  55.88,17.14 180 top
C6  10.79,20.19 180 top
C7  24.89,12.45 0 top
C8  34.54,12.45 0 top
C9  44.58,12.32 0 top
C10  45.47,13.84 270 top
C11  34.92,19.68 90 top
C12  41.78,18.29 180 top
C13  51.44,37.34 0 top
C14  44.96,37.34 0 top
C15  49.28,21.59 180 top
C16  55.63,21.08 180 top
C17  64.52,39.62 90 top
C18  58.93,39.62 90 top
C19  10.79,18.54 0 top
C20  21.59,11.94 0 top
C21  31.37,11.94 0 top
C22  41.53,11.94 0 top
C23  47.75,14.1 90 top
C24  18.41,10.16 90 top
C25  29.21,4.45 90 top
C26  38.73,4.45 90 top
C27  48.9,3.81 90 top
C28  57.15,10.16 90 top
GND  11.43,23.88 0 top
J1  34.04,33.02 0 top
JP1  4.45,38.1 90 top
JP2  4.45,26.67 90 top
L1  13.34,10.16 0 top
L2  24.13,3.81 0 top
L3  33.66,3.81 0 top
L4  43.81,3.81 0 top
L5  52.07,10.16 0 top
LINUX  26.42,45.72 0 top
MOD0  47.75,53.34 270 top
MOD1  37.59,50.04 0 top
MOD2  36.07,53.34 0 top
MOD5  53.34,48.26 0 top
MOD6  57.91,48.26 0 top
MOD7  48.77,43.18 0 top
R1  38.73,17.14 0 top
R2  44.83,17.14 0 top
R3  48.51,37.85 180 top
R4  42.16,37.85 180 top
R5  52.32,19.56 0 top
R6  59.69,19.56 0 top
R7  61.98,40.13 180 top
R8  56.39,40.13 180 top
R9  38.86,23.11 270 top
R10  40.13,23.11 270 top
R11  37.34,23.11 270 top
R12  44.7,23.11 270 top
R13  48.26,20.07 0 top
R14  42.93,23.11 270 top
R15  48.01,32.51 90 top
R16  46.23,32.51 90 top
R17  49.78,32.51 90 top
R18  42.67,32.51 90 top
R19  40.89,32.51 90 top
R20  44.45,32.51 90 top
R21  61.72,34.8 90 top
R22  59.94,34.8 90 top
R23  63.5,34.8 90 top
R24  59.94,25.65 270 top
R25  63.25,22.1 270 top
R26  58.17,25.65 270 top
R27  52.83,25.65 270 top
R28  54.61,25.65 270 top
R29  51.05,25.65 270 top
R30  56.39,34.8 90 top
R31  54.61,34.8 90 top
R32  58.17,34.8 90 top
R33  16.51,12.7 270 top
R34  36.83,6.35 270 top
R35  27.3,6.35 270 top
R36  46.99,6.35 270 top
R37  55.24,12.7 270 top
R38  37.47,8.89 0 top
R39  27.94,8.89 0 top
R40  47.62,8.89 0 top
R41  55.88,15.24 0 top
R42  17.14,15.24 0 top
R43  38.73,6.35 270 top
R44  29.21,6.35 270 top
R45  48.9,6.35 270 top
R46  57.15,12.7 270 top
R47  18.41,12.7 270 top
SCL  35.81,33.27 0 top
SDA  35.81,29.46 0 top
U1  13.34,15.24 0 top
U2  24.13,8.89 0 top
U3  33.66,8.89 0 top
U4  43.81,8.89 0 top
U5  52.07,15.24 0 top
U6  42.42,27.69 0 top
U7  56.39,30.23 0 top
U8  38.73,19.68 90 top
U9  44.83,19.68 90 top
U10  48.51,35.56 270 top
U11  42.16,35.56 270 top
U12  52.32,22.1 90 top
U13  59.69,22.1 90 top
U14  61.98,37.85 270 top
U15  56.39,37.85 270 top
U$1  [UCB_CAL_200MIL]  11.68,51.31 0 top
VBATT  11.43,31.5 0 top
VSOL+  11.43,43.69 0 top
VSOL-  11.43,36.07 0 top

### Tracks (layer width: path | path; a pad name or v marks a point on that pad's centre or on a via)
3V3  (via drill 0.6)
  Top 0.254: v37.08,21.59 37.08,22.43 R11.2 | v39.12,21.59 38.86,21.84 R9.2 R10.2
  Top 0.305: U1.14 11.04,15.49 10.79,15.24 v10.79,13.34
  Top 0.406: L1.P$2 15.24,10.16 | 15.24,10.16 16.51,11.43 R33.2 | R33.2 R47.2 C24.2 | R33.2 15.04,12.27 v14.61,12.7 | U8.1 40.16,17.67 R1.2 39.76,17.02 v41.66,17.02 | 3V3.TESTPOINT 17.02,8.38 15.24,10.16
  Bottom 0.254: v37.08,21.59 v39.12,21.59 39.12,19.56 v41.66,17.02
  Bottom 0.406: v14.61,12.7 11.43,12.7 v10.79,13.34
  Bottom 1.524: v14.61,12.7 37.34,12.7 v41.66,17.02
5V_1  (via drill 0.6)
  Top 0.254: R14.2 R12.2 45.67,22.68 v45.72,22.73 | R13.2 48.69,18.72 v46.99,17.02
  Top 0.305: v31.11,6.99 31.11,8.89 31.36,9.14 U3.14
  Top 0.406: R34.2 R43.2 C26.2 | R34.2 35.36,5.92 v34.92,6.35 | R34.2 36.83,5.08 35.56,3.81 L3.P$2 | U9.1 46.26,17.67 R2.2 45.86,17.02
  Top 1.016: v46.99,17.02 45.86,17.02
  Bottom 0.254: v46.99,17.02 46.99,21.46 v45.72,22.73
  Bottom 0.406: v34.92,6.35 31.75,6.35 v31.11,6.99 29.97,5.84 5V_1.TESTPOINT
  Bottom 1.524: v34.92,6.35 36.32,6.35 v46.99,17.02
5V_2  (via drill 0.6)
  Top 0.254: v48.9,33.66 48.9,33.02 | 48.9,33.02 49.71,33.02 R17.2 | R15.2 48.01,33.02 48.9,33.02 | v45.34,33.66 45.34,33.02 | 45.34,33.02 46.15,33.02 R16.2 | 45.34,33.02 44.52,33.02 R20.2 | U10.1 | v41.78,33.66 41.78,33.02 | 41.78,33.02 42.6,33.02 R18.2 | 41.78,33.02 40.97,33.02 R19.2
  Top 0.305: v21.59,6.99 21.59,8.89 21.84,9.14 U2.14
  Top 0.406: R35.2 27.3,5.08 26.04,3.81 L2.P$2 | R35.2 R44.2 C25.2 | R35.2 25.83,5.92 v25.4,6.35 | v21.59,6.99 20.32,5.71 5V_2.TESTPOINT | U10.1 47.09,37.32 R3.2 | U11.1 40.74,37.32 R4.2
  Top 1.016: R3.2 47.61,39.51 v47.5,39.62 | R4.2 41.26,38.72 v42.16,39.62
  Bottom 0.406: v25.4,6.35 22.23,6.35 v21.59,6.99 | v48.9,33.66 48.77,33.53
  Bottom 1.524: v25.4,6.35 29.84,10.79 38.1,10.79 43.69,16.38 43.69,23.11 49.28,28.7 49.28,33.78 | v41.78,33.66 v45.34,33.66 v48.9,33.66 49.15,33.66 49.28,33.78 | 49.28,33.78 49.28,37.85 v47.5,39.62 v42.16,39.62
5V_3  (via drill 0.6)
  Top 0.254: U12.1 54.61,21.59 55.88,23.11 v55.88,24.13 | R29.2 51.05,24.26 v50.93,24.13 | R28.2 R27.2 52.83,24.64 v53.34,24.13 | R26.2 58.17,24.13 v58.29,24 | v60.2,24.13 60.2,24.97 R24.2 | R25.2 63.18,21.6 63.18,20.76 62.74,20.32 61.12,20.32
  Top 0.305: v41.27,6.99 41.27,8.89 41.52,9.14 U4.14
  Top 0.406: C27.2 R45.2 R36.2 | L4.P$2 45.72,3.81 46.99,5.08 R36.2 | R36.2 45.52,5.92 v45.09,6.35 | U12.1 53.75,20.08 R5.2 53.73,19.05 v55.37,19.05 57.4,19.05 58.17,18.29 60.45,18.29 60.71,18.54 60.71,19.44 R6.2 | 60.71,19.67 R6.2 | U13.1 61.12,20.32 61.12,20.08 R6.2
  Bottom 0.254: v60.2,24.13 58.42,24.13 v58.29,24 58.17,24.13 v55.88,24.13 v53.34,24.13 v50.93,24.13
  Bottom 0.406: v45.09,6.35 41.91,6.35 v41.27,6.99 39.88,5.59 5V_3.TESTPOINT
  Bottom 1.524: v45.09,6.35 51.05,6.35 55.37,10.67 v55.37,19.05
5V_4  (via drill 0.6)
  Top 0.254: R30.2 56.39,35.31 55.5,35.31 | 55.5,35.31 v55.5,35.94 | R31.2 54.66,35.23 54.74,35.31 55.5,35.31 | R32.2 58.22,35.23 58.29,35.31 59.05,35.31 | v59.05,35.94 59.05,35.31 | 59.05,35.31 59.87,35.31 R22.2 | R21.2 61.77,35.23 61.85,35.31 62.61,35.31 | 62.61,35.31 63.42,35.31 R23.2 | v62.61,35.94 62.61,35.31 | U14.1
  Top 0.305: v49.53,13.34 49.53,15.24 49.78,15.49 U5.14
  Top 0.406: R37.2 R46.2 C28.2 | R37.2 53.77,12.27 v53.34,12.7 | L5.P$2 53.98,10.16 55.24,11.43 R37.2 | U15.1 54.96,39.61 R8.2 | U14.1 60.55,39.61 R7.2
  Top 1.016: R8.2 55.49,41.77 v55.63,41.91 | R7.2 61.08,41.79 v60.96,41.91
  Bottom 0.254: v55.5,35.94 v59.05,35.94 v62.61,35.94
  Bottom 0.406: 5V_4.TESTPOINT 62.61,28.7
  Bottom 1.524: v53.34,12.7 50.16,12.7 v49.53,13.34 49.53,16.51 54.61,21.59 60.33,21.59 62.61,23.88 62.61,28.7 v62.61,35.94 62.61,40.26 v60.96,41.91 v55.63,41.91
!INT  (via drill 0.6)
  Top 0.254: J1.6 40.64,59.44 v40.64,48.26 | U7.17 55.64,32.75 55.12,33.27 53.34,33.27 50.67,30.61 v47.75,30.61 | U6.17 41.66,29.43 41.66,30.99 41.4,31.24 39.37,31.24 v38.61,32 38.61,36.58 | 38.61,36.58 38.61,37.59 40.64,39.62 v40.64,42.67 | !INT.TESTPOINT 38.61,36.58
  Bottom 0.254: v40.64,48.26 v40.64,42.67 | v47.75,30.61 46.35,30.61 45.72,31.24 39.37,31.24 v38.61,32
GND  (via drill 0.2, 0.6)
  Top 0.254: U12.2 54.36,22.1 54.86,22.61 v54.86,23.24 | U6.2 40.08,25.96 39.88,26.16 39.88,26.63 U6.1
  other vias: 54.99,56.26 12.83,15.75 13.84,15.75 13.34,15.24 12.83,14.73 13.84,14.73 24.13,8.89 23.62,9.4 24.64,9.4 23.62,8.38 24.64,8.38 33.66,8.89 33.15,9.4 34.16,9.4 34.16,8.38 33.15,8.38 43.81,8.89 43.31,8.38 44.32,8.38 44.32,9.4 43.31,9.4 52.07,15.24 51.56,15.75 52.58,15.75 52.58,14.73 51.56,14.73 66.04,44.45 53.85,42.8 42.55,41.91 23.5,45.72 33.02,42.16 33.66,26.16 66.04,33.78 23.5,21.59 12.7,6.99 51.44,4.06 66.04,24.13 23.5,33.02 41.53,19.3 57.15,20.07 44.96,36.2 47.88,19.05 62.23,21.34 39.62,36.7 59.44,37.85
  pour Top (rank 2): -1.27,67.31 68.58,67.31 68.58,-1.27 -1.27,-1.27
  pour Bottom (rank 2): -1.27,67.31 68.58,67.31 68.58,-1.27 -1.27,-1.27
N$1
  Top 0.305: C2.2 25.36,10.79 U2.9
N$2
  Top 0.305: U2.1 23.38,6.46 23.5,6.35 24.13,6.35 | U2.3 24.38,6.6 24.13,6.35 | U2.2 23.88,6.6 24.13,6.35
  Top 0.406: L2.P$1 22.78,5.87 23.38,6.46
N$3
  Top 0.305: U2.4 24.99,7.46 25.02,7.49
  Top 0.406: 25.02,7.49 26.59,7.49 R35.1
N$4
  Top 0.305: U2.5 27.85,8.14 | 27.85,8.14 R44.1 | R39.2 28.37,8.66 27.85,8.14
N$5
  Top 0.305: C3.2 34.88,10.79 U3.9
N$6
  Top 0.305: U3.1 32.91,6.46 33.02,6.35 33.66,6.35 | U3.2 33.41,6.6 33.66,6.35 | U3.3 33.91,6.6 33.66,6.35
  Top 0.406: L3.P$1 32.3,5.63 33.02,6.35
N$7
  Top 0.305: U3.4 34.45,7.46 34.54,7.37
  Top 0.406: 34.54,7.37 36.25,7.37 R34.1
N$8
  Top 0.305: C4.2 45.04,10.79 U4.9
N$9
  Top 0.305: U3.5 37.38,8.14 | 37.38,8.14 R43.1 | R38.2 37.9,8.66 37.38,8.14
N$10
  Top 0.305: U4.1 43.06,6.46 43.18,6.35 43.81,6.35 | U4.3 44.06,6.6 43.81,6.35 | U4.2 43.56,6.6 43.81,6.35
  Top 0.406: L4.P$1 42.47,5.63 43.18,6.35
N$11
  Top 0.305: U4.4 44.67,7.46 44.7,7.49
  Top 0.406: 44.7,7.49 46.28,7.49 R36.1
N$12
  Top 0.305: U4.5 47.54,8.14 | 47.54,8.14 R45.1 | R40.2 48.06,8.66 47.54,8.14
N$13
  Top 0.305: C5.2 53.3,17.14 U5.9
N$14
  Top 0.305: U5.1 51.32,12.81 51.44,12.7 52.07,12.7 | U5.3 52.32,12.95 52.07,12.7 | U5.2 51.82,12.95 52.07,12.7
  Top 0.406: L5.P$1 50.72,11.98 51.44,12.7
N$15
  Top 0.305: U5.4 52.93,13.81 52.96,13.84
  Top 0.406: 52.96,13.84 54.53,13.84 R37.1
N$16
  Top 0.305: U5.5 55.79,14.49 | 55.79,14.49 R46.1 | R41.2 56.31,15.01 55.79,14.49
N$20  (via drill 0.6)
  other vias: 4.45,45.72
N$21
  Top 0.254: U12.4 50.9,22.96 51.82,23.88 51.82,25.65 52.25,26.09 R27.1 52.83,26.42 53.34,26.92 55.37,26.92 56.13,27.69 U7.5
N$22
  Top 0.254: U12.3 53.75,23.27 55.37,24.89 55.37,25.91 55.12,26.16 | 55.12,26.16 54.69,26.16 R28.1 | 55.12,26.16 55.37,26.16 56.64,27.43 U7.6
N$23
  Top 0.254: U7.12 59.31,31.96 61.05,33.69 61.09,33.73 | 61.09,33.73 R21.1 | U14.4 63.4,37.24 62.99,36.83 61.59,36.83 61.09,36.32 61.09,33.73
N$24
  Top 0.254: U7.13 57.64,32.49 59.44,34.29 59.87,34.29 R22.1 60.15,34.37 60.58,34.8 60.58,37.32 U14.3
N$25
  Top 0.254: U7.11 60.11,30.98 R23.1 63.83,34.37 64.26,34.8 64.26,37.59 64.01,37.85 U14.5
N$26
  Top 0.254: U7.15 56.64,34.11 R30.1 56.59,34.37 57.02,34.8 57.02,36.2 57.66,36.83 57.66,37.19 U15.4
N$27
  Top 0.254: U7.16 56.14,33.02 54.79,34.37 R31.1 54.28,34.37 53.85,34.8 53.85,36.23 U15.3
N$28  (via drill 0.6)
  other vias: 4.45,33.66
N$29  (via drill 0.6)
  other vias: 4.45,21.59
N$30  (via drill 0.6)
  other vias: 13.08,58.8
N$43
  Top 0.254: U8.4 37.31,20.29 38.1,21.08 38.1,23.37 38.35,23.62 38.79,23.62 R9.1 38.86,23.62 39.88,24.64 41.66,24.64 42.16,25.15 U6.5
N$46
  Top 0.254: U7.14 57.14,33.34 57.37,33.56 57.53,33.73 | 57.53,33.73 R32.1 | U15.5 58.42,37.85 58.67,37.59 58.67,37.21 57.53,36.07 57.53,33.73
N$47
  Top 0.254: 41.4,23.62 40.21,23.62 R10.1 | U8.3 41.4,21.42 41.4,23.62 | 41.4,23.62 42.67,24.89 U6.6
N$48
  Top 0.254: U12.5 50.29,22.1 50.04,22.35 50.04,25.4 50.73,26.09 R29.1 51.05,26.16 52.32,27.43 55.12,27.43 55.63,27.94 55.63,28.48 U7.4
N$49
  Top 0.254: U13.4 58.27,22.7 59.18,23.62 59.18,25.91 59.44,26.16 | 59.44,26.16 59.87,26.16 R24.1 | U7.8 57.64,27.96 59.44,26.16
N$50
  Top 0.254: U7.9 58.14,28.22 59.69,26.67 60.45,26.67 61.47,25.65 61.47,23.88 61.12,23.52 U13.3 63.18,22.6 R25.1
N$51
  Top 0.254: U13.5 57.66,22.1 57.4,22.35 57.4,25.91 57.53,26.04 | 57.53,26.04 57.66,26.16 58.09,26.16 R26.1 | U7.7 57.14,26.43 57.53,26.04
N$52
  Top 0.254: U10.4 49.94,34.95 49.53,34.54 48.26,34.54 47.37,33.66 47.37,32 | R15.1 47.45,32.08 47.37,32 | 47.37,32 47.24,32 46.74,31.5 45.97,31.5 44.17,29.69 U6.12
N$53
  Top 0.254: U10.3 46.86,34.83 46.86,32.38 46.56,32.08 R16.1 46.15,32 45.72,32 43.67,29.95 U6.13
N$54
  Top 0.254: R17.1 49.71,32 49.71,31.93 | R17.1 50.37,32.08 50.8,32.51 50.8,35.31 50.55,35.56 U10.5 | U6.11 44.65,29.41 46.23,30.99 46.99,30.99 47.5,31.5 49.2,31.5 R17.1
N$55
  Top 0.254: U11.4 43.59,34.06 43.31,33.78 43.31,32.38 43,32.08 R18.1 U6.15
N$56
  Top 0.254: U11.3 40.26,34.58 40.26,32.38 40.56,32.08 R19.1 40.97,32 41.66,32 42.16,31.5 U6.16
N$57
  Top 0.254: U11.5 44.2,35.56 44.45,35.31 44.45,34.16 43.81,33.53 43.81,32.26 43.99,32.08 R20.1 44.45,31.5 43.17,30.21 U6.14
N$61
  Top 0.305: C1.2 14.56,17.14 U1.9
N$62
  Top 0.305: 12.06,10.24 L1.P$1 | U1.3 13.59,12.95 13.34,12.7 | U1.2 13.09,12.95 13.34,12.7 | U1.1 12.59,12.81 12.7,12.7 13.34,12.7
  Top 0.406: 12.06,10.24 12.06,12.06 12.7,12.7
N$63
  Top 0.305: U1.4 14.19,13.81 14.22,13.84
  Top 0.406: 14.22,13.84 15.8,13.84 R33.1
N$64
  Top 0.305: U1.5 17.06,14.49 | 17.06,14.49 R47.1 | R42.2 17.58,15.01 17.06,14.49
N$67
  Top 0.254: U8.5 36.7,19.68 36.07,20.32 36.07,22.86 36.83,23.62 37.26,23.62 R11.1 37.34,23.62 38.86,25.15 41.4,25.15 41.66,25.4 41.66,25.94 U6.4
N$68
  Top 0.254: U9.4 43.41,21.05 44.2,21.84 46.23,21.84 46.74,22.35 46.74,23.11 46.23,23.62 44.7,23.62 | 44.7,23.62 44.2,23.62 43.69,24.13 43.69,25.94 U6.8 | R12.1 44.7,23.62
N$70
  Top 0.254: 47.69,20.18 R13.1 47.71,20.18 47.24,20.18 | U9.3 47.24,20.18 | 47.24,20.18 47.24,23.37 46.18,24.43 44.45,24.43 | 44.45,24.43 44.42,24.43 | U6.9 44.17,24.71 44.45,24.43
N$71
  Top 0.254: U9.5 42.67,19.68 42.16,20.19 42.16,23.11 42.67,23.62 42.85,23.62 R14.1 43.18,23.8 43.18,25.94 U6.7
SCL  (via drill 0.6)
  Top 0.254: J1.5 39.12,60.96 v39.12,48.26 | U7.18 55.12,31.98 55.12,32.51 54.86,32.77 53.59,32.77 50.16,29.34 v47.75,29.34 | U6.18 41.15,29.44 41.15,29.97 40.39,30.73 v38.61,30.73
  Bottom 0.254: SCL.TESTPOINT 37.59,33.27 | 37.59,33.27 37.59,31.75 v38.61,30.73 45.21,30.73 46.61,29.34 v47.75,29.34 | v39.12,48.26 39.12,39.62 37.59,38.1 37.59,33.53 37.59,33.27
SDA  (via drill 0.6)
  Top 0.254: U7.19 54.59,32 53.59,32 50.04,28.45 v46.74,28.45 | J1.3 41.66,60.96 41.66,48.26 v41.91,48.26 | v38.61,29.46 40.62,29.46 U6.19 | v41.91,43.69 39.62,43.69 34.54,38.61 34.54,30.73 SDA.TESTPOINT
  Bottom 0.254: v46.74,28.45 45.72,29.46 v38.61,29.46 SDA.TESTPOINT | v41.91,48.26 v41.91,43.69
VBATT
  Top 0.254: U2.13 22.7,9.75 22.73,9.78 | 23.38,11.31 23.38,11.4 23.35,11.43 | 32.23,11.79 32.23,13.68 32.51,13.97
  Top 0.305: U1.13 11.9,16.04 | 12.59,17.26 U1.12 12.59,17.66 12.7,17.78 | U1.11 13.09,17.53 13.34,17.78 13.59,17.53 U1.10 | U2.10 24.38,11.18 24.13,11.43 23.88,11.18 U2.11 | U2.12 23.38,11.31 23.5,11.43 | U3.10 33.91,11.18 33.66,11.43 33.41,11.18 U3.11 | U3.12 32.91,11.31 33.02,11.43 | U3.13 32.23,9.69 | U4.10 44.06,11.18 43.81,11.43 43.56,11.18 U4.11 | U4.12 43.06,11.31 43.18,11.43 | U4.13 42.38,9.69 | U5.10 52.32,17.53 52.07,17.78 51.82,17.53 U5.11 | U5.12 51.32,17.66 51.44,17.78 | U5.13 50.64,16.04
  Top 0.406: 33.66,11.43 33.02,11.43 32.23,11.43 | 43.81,11.43 43.18,11.43 42.43,11.43 | 51.44,17.78 52.07,17.78 | 50.64,16.04 50.64,16.51 | 50.64,16.51 50.64,17.62 50.8,17.78 51.2,17.78 51.32,17.66 | 50.64,16.51 48.9,16.51 47.75,15.37 C23.P$1 47.26,14.61 45.47,14.61 C10.1 | C6.1 11.7,20.19 | 42.38,9.69 42.38,11.22 42.43,11.43 | 42.43,11.43 C22.P$1 | 11.9,16.04 11.9,18.43 C19.P$1 12.56,17.78 12.7,17.78 13.34,17.78 | 11.79,20.05 11.94,20.19 | 24.13,11.43 23.35,11.43 22.73,11.43 | 22.73,12.05 C20.P$1 22.73,11.79 22.73,11.43 | 22.73,9.78 22.73,11.43 | 32.23,9.69 32.23,11.43 | 32.23,11.43 32.23,11.79 C21.P$1 | 18.41,20.95 17.78,20.95
  Top 1.016: J1.17 25.15,63.75 24.77,64.14 19.68,64.14 17.78,62.23 | C19.P$1 11.79,20.05
  Top 1.27: 18.41,20.95 18.41,20.32 18.29,20.19 | 11.7,20.19 11.94,20.19
  Top 1.524: 11.94,20.19 18.29,20.19 | 18.41,20.32 18.41,19.18 23.62,13.97 32.51,13.97 43.69,13.97
  Top 1.778: VBATT.TESTPOINT 11.43,29.21
  Top 2.54: JP2.2 11.43,29.21 17.78,29.21
  Top 3.048: 17.78,62.23 17.78,29.21 17.78,20.95
  pour Top (isolate 0.127): 16.26,62.23 16.26,63.05 arc-71 16.68,63.65 19.56,64.64 19.68,63.37 19.3,62.23 16.51,62.23
  pour Top (no thermals): 12.06,20.83 11.64,20.83 arc37 11.26,20.7 10.92,20.45 10.92,19.94 11.26,19.68 arc37 11.64,19.56 12.06,19.56
  pour Top (no thermals): 22.35,14.48 22.35,11.43 24,11.43 24.64,12.06 24.64,14.48
  pour Top (no thermals): 32,13.72 32,11.43 33.78,11.43 34.29,11.94 34.29,13.72
  pour Top (no thermals): 42.16,13.97 42.16,11.43 43.94,11.43 44.45,11.94 44.45,13.46 44.96,13.97 45.72,13.97 45.72,14.73 43.69,14.73
  pour Top (no thermals): 11.94,17.78 13.46,17.78 13.46,19.81 11.94,19.81
VCC_BACKPLANE  (via drill 0.6)
  Top 0.254: 30.86,28.19 30.87,28.21 30.87,28.44 30.86,28.45 | 30.87,30.98 30.86,30.99 | 30.87,28.94 30.86,28.96 | v45.72,27.43 50.04,27.43 52.08,29.48 | U7.20 54.15,30.99 53.59,30.99 52.08,29.48 | U7.1 52.08,29.48 | C11.1 33.86,19.25 33.66,19.05 | 30.86,27.43 v38.86,27.43 39.18,27.43 U6.20
  Top 0.305: U8.6 34.99,19.18
  Top 0.406: U8.6 37.31,17.67 R1.1 | J1.13 31.5,60.96 31.5,57.78 30.86,57.15 | C11.1 34.99,19.18 | BACK.TESTPOINT 31.11,45.72 30.86,45.97
  Top 1.524: 33.66,19.05 30.86,21.84 30.86,27.43 30.86,28.19 30.86,28.45 30.86,28.96 30.86,30.99 30.86,45.97 30.86,57.15
  Bottom 0.254: v38.86,27.43 v45.72,27.43
  Bottom 0.406: J1.2 45.72,59.69 46.99,60.96 46.99,63.5 46.35,64.14 32.13,64.14 J1.13
  pour Top (no thermals): 33.66,19.81 34.1,19.81 arc-34 34.45,19.71 34.67,19.56 35.18,19.56 35.18,18.92 34.67,18.92 34.22,18.47 arc-45 33.77,18.29 33.66,18.29
  pour Top: 30.1,57.15 30.1,57.52 arc-45 30.28,57.97 31.37,59.05 31.62,59.05 31.62,57.15
VCC_LINUX
  Top 0.406: 43.93,16.88 R2.1 43.41,17.67 43.41,18.29 | U9.6 43.41,18.29 | J1.4 44.2,60.96 44.2,63.12 43.18,64.14 29.84,64.14 28.96,63.25 28.96,57.53 28.57,57.15 | LINUX.TESTPOINT 28.57,45.72 | C12.1 43.41,18.29
  Top 1.016: 43.93,16.88 42.8,15.75 34.29,15.75
  Top 1.524: 28.57,57.15 28.57,45.72 28.57,20.7 33.27,16
  pour Top: 27.81,57.15 27.81,57.52 arc-45 28,57.97 28.83,58.8 29.3,57.37 arc-18 29.34,57.17 29.34,57.15
  pour Top: 34.29,16.26 arc-45 33.94,16.4 33.71,16.64 33.66,16.64 32.61,15.6 32.78,15.43 arc45 33.23,15.24 34.29,15.24
VCC_MOD0  (via drill 0.6)
  Top 0.406: U10.6 49.94,37.32 | 49.94,37.32 R3.1 | 49.94,37.32 50.98,37.32 C13.1 | MOD0.TESTPOINT 43.43,53.34 43.18,53.59
  Top 1.016: v46.35,48.26 45.09,48.26 43.18,50.16 43.18,53.59 v43.18,57.15 | v46.35,41.4 47.5,41.4 49.41,39.49 R3.1
  Bottom 0.406: J1.7 39.12,60.96 41.15,60.96 41.66,60.45 41.66,58.67 v43.18,57.15
  Bottom 1.016: v46.35,41.4 v46.35,48.26
VCC_MOD1  (via drill 0.6)
  Top 0.406: J1.8 v37.85,53.34 37.85,50.29 MOD1.TESTPOINT | U11.6 43.59,37.32 | 43.59,37.32 R4.1 | C14.1 43.61,37.34 43.59,37.32
  Top 1.016: R4.1 43.06,38.75 44.45,40.13 v44.45,41.4
  Bottom 1.016: v37.85,53.34 41.27,53.34 44.45,50.16 v44.45,41.4
VCC_MOD2  (via drill 0.6)
  Top 0.406: R5.1 50.9,20.08 U12.6 C15.1 49.71,21.92 49.02,22.61 v49.02,22.86 | J1.9 36.58,60.96 v36.58,56.9 36.58,53.72 MOD2.TESTPOINT
  Bottom 0.406: v36.58,56.9 36.58,56.77
  Bottom 1.016: 36.58,56.77 38.1,55.24 41.27,55.24 50.8,45.72 50.8,27.94 49.02,26.16 v49.02,22.86
VCC_MOD5  (via drill 0.6)
  Top 0.406: U13.6 58.27,21.08 | 58.27,21.08 58.27,20.08 R6.1 | 58.27,21.08 C16.1 56.06,22.53 56.9,23.37 56.9,24.89 v56.39,25.4
  Bottom 0.406: J1.10 35.56,59.69 | MOD5.TESTPOINT 51.75,46.67
  Bottom 1.016: 35.56,59.69 38.1,57.15 41.27,57.15 51.75,46.67 52.07,46.35 52.07,29.72 v56.39,25.4
VCC_MOD6
  Top 0.406: J1.11 34.04,60.96 34.04,57.4 34.29,57.15 | U14.6 63.4,39.12 | 63.4,39.12 63.4,39.61 R7.1 | C17.1 63.48,39.19 63.4,39.12 | MOD6.TESTPOINT 57.91,46.61 57.66,46.35
  Top 1.016: 34.29,57.15 34.29,50.8 38.73,46.35 57.66,46.35 58.29,46.35 62.88,41.77 R7.1
  pour Top: 33.78,57.15 33.78,57.72 arc-11 33.79,57.85 33.91,58.42 34.16,58.42 34.74,57.39 arc-29 34.8,57.15
VCC_MOD7
  Top 0.406: U15.6 57.81,39.12 | 57.81,39.12 57.81,39.61 R8.1 | C18.1 57.89,39.19 57.81,39.12 | MOD7.TESTPOINT 48.77,45.09
  Top 1.016: J1.12 32.77,50.42 38.1,45.09 48.77,45.09 54.23,45.09 57.29,42.03 R8.1
VSOL+
  Bottom 0.406: JP1.2 6.35,42.55
  Bottom 1.778: VSOL+.TESTPOINT 11.43,47.62
  Bottom 3.048: 19.68,61.59 17.78,59.69 17.78,53.98 11.43,47.62 6.35,42.55
  pour Bottom (no thermals): 7.11,41.27 5.08,43.31 3.81,41.27 3.81,40.01 5.08,40.01
  pour Bottom (no thermals): 22.61,62.99 19.68,63.12 19.68,60.33 20.57,60.33 22.61,61.47
VSOL-
  Bottom 1.778: VSOL-.TESTPOINT 11.43,37.47 10.79,38.1
  Bottom 3.048: 22.61,57.15 22.61,49.91 10.79,38.1 6.86,38.1
  pour Bottom (no thermals): 21.08,57.15 21.55,59.5 arc-34 21.73,59.83 22.35,60.45 22.86,60.45 23.4,59.8 arc-26 23.53,59.55 24.13,57.15
  pour Bottom (no thermals): 6.86,39.62 5.35,39.62 4.45,39.25 4.06,38.86 4.06,37.59 4.06,37.34 4.45,36.95 5.35,36.58 6.86,36.58

### Text on the board
tPlace: Signpost / Power Module / Neal Jackson / 9/19/2016 | B
tNames: VSOL+ | VSOL- | VBATT+ | VBATT-